# EAGLE design M8655B (EAGLE 6.6.0)

## Sheet 1 of 3
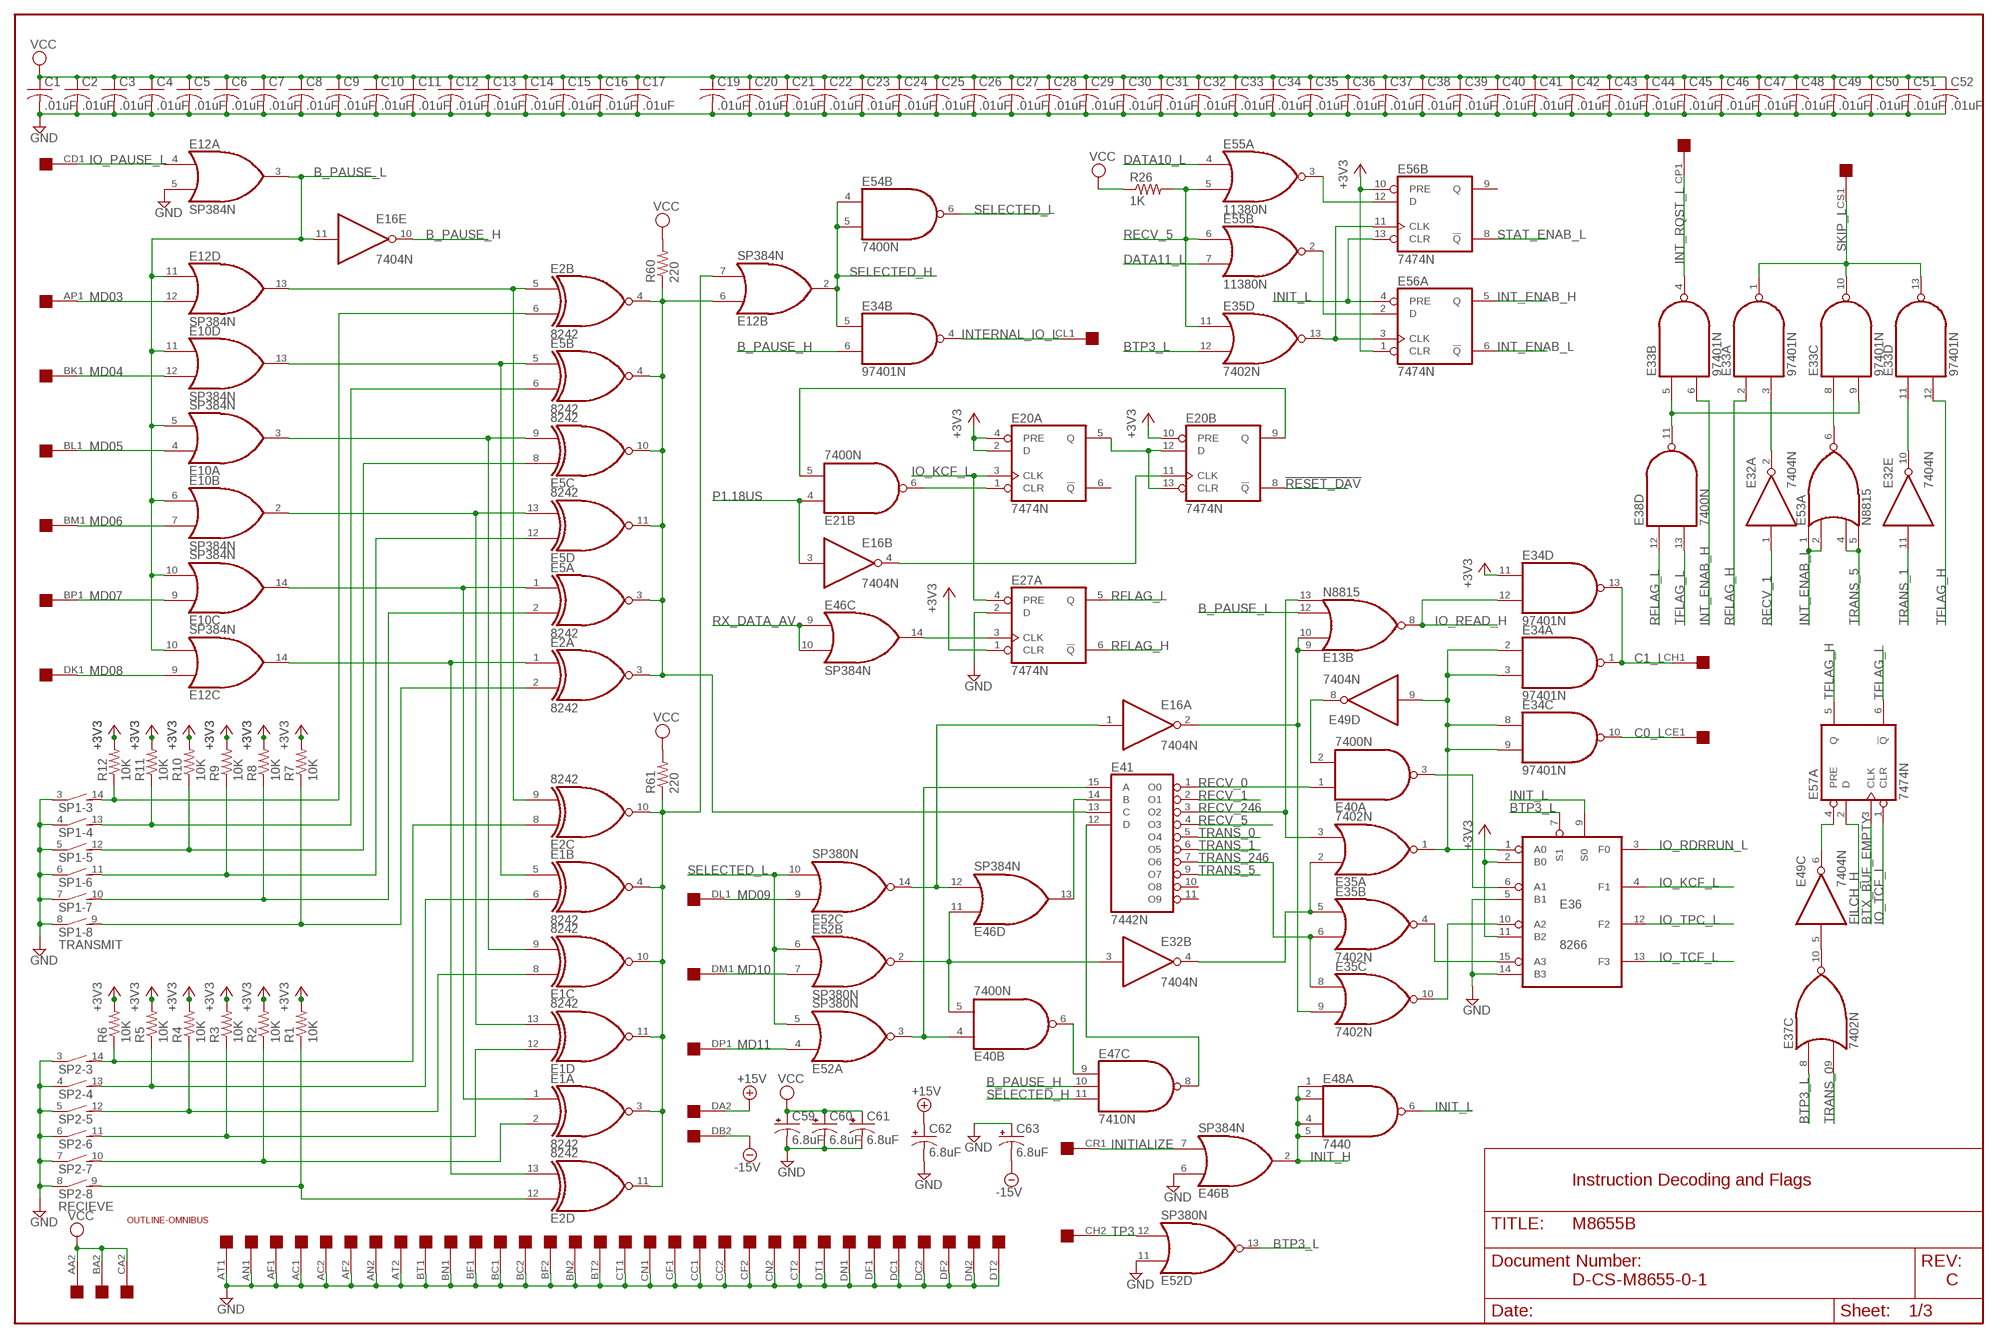
[diagram p0: schematic, sheet 1]

### Parts
C1  .01uF  C-US050-025X075  [C050-025X075]
C2  .01uF  C-US050-025X075  [C050-025X075]
C3  .01uF  C-US050-025X075  [C050-025X075]
C4  .01uF  C-US050-025X075  [C050-025X075]
C5  .01uF  C-US050-025X075  [C050-025X075]
C6  .01uF  C-US050-025X075  [C050-025X075]
C7  .01uF  C-US050-025X075  [C050-025X075]
C8  .01uF  C-US050-025X075  [C050-025X075]
C9  .01uF  C-US050-025X075  [C050-025X075]
C10  .01uF  C-US050-025X075  [C050-025X075]
C11  .01uF  C-US050-025X075  [C050-025X075]
C12  .01uF  C-US050-025X075  [C050-025X075]
C13  .01uF  C-US050-025X075  [C050-025X075]
C14  .01uF  C-US050-025X075  [C050-025X075]
C15  .01uF  C-US050-025X075  [C050-025X075]
C16  .01uF  C-US050-025X075  [C050-025X075]
C17  .01uF  C-US050-025X075  [C050-025X075]
C19  .01uF  C-US050-025X075  [C050-025X075]
C20  .01uF  C-US050-025X075  [C050-025X075]
C21  .01uF  C-US050-025X075  [C050-025X075]
C22  .01uF  C-US050-025X075  [C050-025X075]
C23  .01uF  C-US050-025X075  [C050-025X075]
C24  .01uF  C-US050-025X075  [C050-025X075]
C25  .01uF  C-US050-025X075  [C050-025X075]
C26  .01uF  C-US050-025X075  [C050-025X075]
C27  .01uF  C-US050-025X075  [C050-025X075]
C28  .01uF  C-US050-025X075  [C050-025X075]
C29  .01uF  C-US050-025X075  [C050-025X075]
C30  .01uF  C-US050-025X075  [C050-025X075]
C31  .01uF  C-US050-025X075  [C050-025X075]
C32  .01uF  C-US050-025X075  [C050-025X075]
C33  .01uF  C-US050-025X075  [C050-025X075]
C34  .01uF  C-US050-025X075  [C050-025X075]
C35  .01uF  C-US050-025X075  [C050-025X075]
C36  .01uF  C-US050-025X075  [C050-025X075]
C37  .01uF  C-US050-025X075  [C050-025X075]
C38  .01uF  C-US050-025X075  [C050-025X075]
C39  .01uF  C-US050-025X075  [C050-025X075]
C40  .01uF  C-US050-025X075  [C050-025X075]
C41  .01uF  C-US050-025X075  [C050-025X075]
C42  .01uF  C-US050-025X075  [C050-025X075]
C43  .01uF  C-US050-025X075  [C050-025X075]
C44  .01uF  C-US050-025X075  [C050-025X075]
C45  .01uF  C-US050-025X075  [C050-025X075]
C46  .01uF  C-US050-025X075  [C050-025X075]
C47  .01uF  C-US050-025X075  [C050-025X075]
C48  .01uF  C-US050-025X075  [C050-025X075]
C49  .01uF  C-US050-025X075  [C050-025X075]
C50  .01uF  C-US050-025X075  [C050-025X075]
C51  .01uF  C-US050-025X075  [C050-025X075]
C52  .01uF  C-US050-025X075  [C050-025X075]
C59  6.8uF  CPOL-USE20-8AXIAL  [E12-8]
C60  6.8uF  CPOL-USE20-8AXIAL  [E12-8]
C61  6.8uF  CPOL-USE20-8AXIAL  [E12-8]
C62  6.8uF  CPOL-USE20-8AXIAL  [E12-8]
C63  6.8uF  CPOL-USE20-8AXIAL  [E12-8]
E1  8242  74LS266N  [DIL14]
E2  8242  74LS266N  [DIL14]
E5  8242  74LS266N  [DIL14]
E10  SP384N  [DIL14]
E12  SP384N  [DIL14]
E13  N8815  [DIL14]
E16  7404N  [DIL14]
E20  7474N  74S74N  [DIL14]
E21  7400N  [DIL14]
E27  7474N  74S74N  [DIL14]
E32  7404N  [DIL14]
E33  97401N  74LS01N  [DIL14]
E34  97401N  74LS01N  [DIL14]
E35  7402N  [DIL14]
E36  8266  [DIL16]
E37  7402N  [DIL14]
E38  7400N  [DIL14]
E40  7400N  [DIL14]
E41  7442N  74LS42N  [DIL16]
E46  SP384N  [DIL14]
E47  7410N  [DIL14]
E48  7440  74S20N  [DIL14]
E49  7404N  [DIL14]
E52  SP380N  [DIL14]
E53  N8815  [DIL14]
E54  7400N  [DIL14]
E55  11380N  SP380N  [DIL14]
E56  7474N  74S74N  [DIL14]
E57  7474N  74S74N  [DIL14]
R1  10K  R-US_0207/10  [0207/10]
R2  10K  R-US_0207/10  [0207/10]
R3  10K  R-US_0207/10  [0207/10]
R4  10K  R-US_0207/10  [0207/10]
R5  10K  R-US_0207/10  [0207/10]
R6  10K  R-US_0207/10  [0207/10]
R7  10K  R-US_0207/10  [0207/10]
R8  10K  R-US_0207/10  [0207/10]
R9  10K  R-US_0207/10  [0207/10]
R10  10K  R-US_0207/10  [0207/10]
R11  10K  R-US_0207/10  [0207/10]
R12  10K  R-US_0207/10  [0207/10]
R26  1K  R-US_0207/10  [0207/10]
R60  220  R-US_0207/10  [0207/10]
R61  220  R-US_0207/10  [0207/10]
SP1  TRANSMIT  DIP08S  [DIP08S]
SP2  RECIEVE  DIP08S  [DIP08S]
U$1  OUTLINE-OMNIBUS  [OMNIBUS]
U$2  QUAD  [EDGE-CON8]

### Nets
!RESET_DAV: E20.8(B:!Q) ; also sheet 3
+3V3: E20.2(A:D) E20.4(A:PRE) E20.10(B:PRE) E27.1(A:CLR) E34.11(D:I0) E36.2(B0) E36.11(B2) E56.1(A:CLR) E56.10(B:PRE) R1.2 R2.2 R3.2 R4.2 R5.2 R6.2 R7.2 R8.2 R9.2 R10.2 R11.2 R12.2 ; also sheet 2,3
+15V: C62.+ U$2.DA2 ; also sheet 3
-15V: C63.- U$2.DB2 ; also sheet 3
B_PAUSE_H: E16.10(E:O) E34.6(B:I1) E47.10(C:I1)
B_PAUSE_L: E10.5(A:I1) E10.6(B:I0) E10.10(C:I1) E10.11(D:I0) E12.3(A:O) E12.10(C:I1) E12.11(D:I0) E13.12(B:I2) E16.11(E:I) ; also sheet 3
BTP3_L: E35.12(D:I1) E36.7(S1) E37.8(C:I0) E52.13(D:O)
BTX_BUF_EMPTY: E57.3(A:CLK) ; also sheet 2
C0_L: E34.10(C:O) U$2.CE1
C1_L: E34.1(A:O) E34.13(D:O) U$2.CH1
DATA10_L: E55.4(A:I0) ; also sheet 3
DATA11_L: E55.7(B:I1) ; also sheet 3
FILCH_H: E57.2(A:D) ; also sheet 2
GND: C1.2 C2.2 C3.2 C4.2 C5.2 C6.2 C7.2 C8.2 C9.2 C10.2 C11.2 C12.2 C13.2 C14.2 C15.2 C16.2 C17.2 C19.2 C20.2 C21.2 C22.2 C23.2 C24.2 C25.2 C26.2 C27.2 C28.2 C29.2 C30.2 C31.2 C32.2 C33.2 C34.2 C35.2 C36.2 C37.2 C38.2 C39.2 C40.2 C41.2 C42.2 C43.2 C44.2 C45.2 C46.2 C47.2 C48.2 C49.2 C50.2 C51.2 C52.2 C59.- C60.- C61.- C62.- C63.+ E12.5(A:I1) E27.2(A:D) E36.5(B1) E36.14(B3) E46.6(B:I0) E52.11(D:I0) SP1.3 SP1.4 SP1.5 SP1.6 SP1.7 SP1.8 SP2.3 SP2.4 SP2.5 SP2.6 SP2.7 SP2.8 U$2.AC1 U$2.AC2 U$2.AF1 U$2.AF2 U$2.AN1 U$2.AN2 U$2.AT1 U$2.AT2 U$2.BC1 U$2.BC2 U$2.BF1 U$2.BF2 U$2.BN1 U$2.BN2 U$2.BT1 U$2.BT2 U$2.CC1 U$2.CC2 U$2.CF1 U$2.CF2 U$2.CN1 U$2.CN2 U$2.CT1 U$2.CT2 U$2.DC1 U$2.DC2 U$2.DF1 U$2.DF2 U$2.DN1 U$2.DN2 U$2.DT1 U$2.DT2 ; also sheet 2,3
INIT_H: E46.2(B:O) E48.1(A:I0) E48.2(A:I1) E48.4(A:I2) E48.5(A:I3) ; also sheet 2
INIT_L: E36.9(S0) E48.6(A:O) E56.4(A:PRE) E56.13(B:CLR) ; also sheet 2,3
INITIALIZE: E46.7(B:I1) U$2.CR1
INT_ENAB_H: E33.6(B:I1) E56.5(A:Q)
INT_ENAB_L: E53.1(A:I0) E53.2(A:I1) E56.6(A:!Q)
INT_RQST_L: E33.4(B:O) U$2.CP1
INTERNAL_IO_L: E34.4(B:O) U$2.CL1
IO_KCF_L: E20.3(A:CLK) E27.4(A:PRE) E36.4(F1)
IO_PAUSE_L: E12.4(A:I0) U$2.CD1
IO_RDRRUN_L: E36.3(F0) ; also sheet 3
IO_READ_H: E13.8(B:O) E34.12(D:I1) ; also sheet 3
IO_TCF_L: E36.13(F3) E57.1(A:CLR)
IO_TPC_L: E36.12(F2) ; also sheet 2,3
MD03: E12.12(D:I1) U$2.AP1
MD04: E10.12(D:I1) U$2.BK1
MD05: E10.4(A:I0) U$2.BL1
MD06: E10.7(B:I1) U$2.BM1
MD07: E10.9(C:I0) U$2.BP1
MD08: E12.9(C:I0) U$2.DK1
MD09: E52.9(C:I0) U$2.DL1
MD10: E52.7(B:I1) U$2.DM1
MD11: E52.4(A:I0) U$2.DP1
N$1: E2.6(B:I1) R12.1 SP1.14
N$2: E5.6(B:I1) R11.1 SP1.13
N$3: E5.8(C:I0) R10.1 SP1.12
N$4: E5.12(D:I0) R9.1 SP1.11
N$5: E5.2(A:I1) R8.1 SP1.10
N$6: E2.2(A:I1) R7.1 SP1.9
N$7: E2.5(B:I0) E2.9(C:I1) E12.13(D:O)
N$8: E2.8(C:I0) R6.1 SP2.14
N$9: E1.6(B:I1) R5.1 SP2.13
N$10: E1.8(C:I0) R4.1 SP2.12
N$11: E1.12(D:I0) R3.1 SP2.11
N$12: E1.2(A:I1) R2.1 SP2.10
N$13: E2.12(D:I0) R1.1 SP2.9
N$14: E1.5(B:I0) E5.5(B:I0) E10.13(D:O)
N$15: E1.9(C:I1) E5.9(C:I1) E10.3(A:O)
N$16: E1.13(D:I1) E5.13(D:I1) E10.2(B:O)
N$17: E1.1(A:I0) E5.1(A:I0) E10.14(C:O)
N$18: E2.1(A:I0) E2.13(D:I1) E12.14(C:O)
N$19: E2.3(A:O) E2.4(B:O) E5.3(A:O) E5.4(B:O) E5.10(C:O) E5.11(D:O) E12.6(B:I0) E41.13(C) R60.1
N$20: E1.3(A:O) E1.4(B:O) E1.10(C:O) E1.11(D:O) E2.10(C:O) E2.11(D:O) E12.7(B:I1) R61.1
N$21: E32.3(B:I) E40.5(B:I1) E46.11(D:I0) E52.2(B:O)
N$22: E16.1(A:I) E46.12(D:I1) E52.14(C:O)
N$23: E40.4(B:I0) E41.15(A) E52.3(A:O)
N$24: E34.2(A:I0) E34.3(A:I1) E34.8(C:I0) E34.9(C:I1) E35.1(A:O) E36.1(A0) E49.9(D:I)
N$25: E41.14(B) E46.13(D:O)
N$26: E40.6(B:O) E47.9(C:I0)
N$27: E32.4(B:O) E35.2(A:I0) E35.5(B:I0)
N$28: E41.12(D) E47.8(C:O)
N$29: E13.9(B:I0) E13.10(B:I1) E16.2(A:O) E35.9(C:I1)
N$30: E40.2(A:I1) E49.8(D:O)
N$31: E35.4(B:O) E36.15(A3)
N$32: E35.10(C:O) E36.10(A2)
N$33: E36.6(A1) E40.3(A:O)
N$34: E20.5(A:Q) E20.12(B:D) E20.13(B:CLR)
N$35: E20.1(A:CLR) E21.6(B:O)
N$36: E27.3(A:CLK) E46.14(C:O)
N$37: E16.4(B:O) E20.11(B:CLK)
N$38: E20.9(B:Q) E21.5(B:I1)
N$39: E35.13(D:O) E56.3(A:CLK) E56.11(B:CLK)
N$40: E55.2(B:O) E56.2(A:D)
N$41: E55.3(A:O) E56.12(B:D)
N$42: E37.10(C:O) E49.5(C:I)
N$43: E49.6(C:O) E57.4(A:PRE)
N$45: E32.2(A:O) E33.3(A:I1)
N$46: E32.10(E:O) E33.11(D:I0)
N$47: E33.8(C:I0) E53.6(A:O)
N$48: E33.5(B:I0) E33.9(C:I1) E38.11(D:O)
P1.18US: E16.3(B:I) E21.4(B:I0) ; also sheet 2
RECV_0: E40.1(A:I0) E41.1(O0)
RECV_1: E32.1(A:I) E41.2(O1)
RECV_5: E35.11(D:I0) E41.4(O3) E55.5(A:I1) E55.6(B:I0) R26.2
RECV_246: E13.13(B:I3) E35.3(A:I1) E41.3(O2)
RFLAG_H: E27.6(A:!Q) E33.2(A:I0)
RFLAG_L: E27.5(A:Q) E38.12(D:I0)
RX_DATA_AV: E46.9(C:I0) E46.10(C:I1) ; also sheet 3
SELECTED_H: E12.2(B:O) E34.5(B:I0) E47.11(C:I2) E54.4(B:I0) E54.5(B:I1)
SELECTED_L: E52.5(A:I1) E52.6(B:I0) E52.10(C:I1) E54.6(B:O)
SKIP_L: E33.1(A:O) E33.10(C:O) E33.13(D:O) U$2.CS1
STAT_ENAB_L: E56.8(B:!Q) ; also sheet 3
TFLAG_H: E33.12(D:I1) E57.5(A:Q)
TFLAG_L: E38.13(D:I1) E57.6(A:!Q)
TP3: E52.12(D:I1) U$2.CH2
TRANS_0: E37.9(C:I1) E41.5(O4)
TRANS_1: E32.11(E:I) E41.6(O5)
TRANS_5: E41.9(O7) E53.4(A:I2) E53.5(A:I3)
TRANS_246: E35.6(B:I1) E35.8(C:I0) E41.7(O6)
VCC: C1.1 C2.1 C3.1 C4.1 C5.1 C6.1 C7.1 C8.1 C9.1 C10.1 C11.1 C12.1 C13.1 C14.1 C15.1 C16.1 C17.1 C19.1 C20.1 C21.1 C22.1 C23.1 C24.1 C25.1 C26.1 C27.1 C28.1 C29.1 C30.1 C31.1 C32.1 C33.1 C34.1 C35.1 C36.1 C37.1 C38.1 C39.1 C40.1 C41.1 C42.1 C43.1 C44.1 C45.1 C46.1 C47.1 C48.1 C49.1 C50.1 C51.1 C52.1 C59.+ C60.+ C61.+ R26.1 R60.2 R61.2 U$2.AA2 U$2.BA2 U$2.CA2 ; also sheet 2,3
Unconnected: E20.6(A:!Q) E38.1(A:I0) E38.2(A:I1) E38.3(A:O) E38.4(B:I0) E38.5(B:I1) E38.6(B:O) E38.8(C:O) E38.9(C:I0) E38.10(C:I1) E41.10(O8) E41.11(O9) E47.3(B:I0) E47.4(B:I1) E47.5(B:I2) E47.6(B:O) E56.9(B:Q) U$2.AA1 U$2.AB1 U$2.AB2 U$2.AD1 U$2.AD2 U$2.AE1 U$2.AE2 U$2.AH1 U$2.AH2 U$2.AJ1 U$2.AJ2 U$2.AK1 U$2.AK2 U$2.AL1 U$2.AL2 U$2.AM1 U$2.AM2 U$2.AP2 U$2.AR2 U$2.AS2 U$2.AU2 U$2.AV2 U$2.BA1 U$2.BB1 U$2.BB2 U$2.BD1 U$2.BD2 U$2.BE1 U$2.BE2 U$2.BH1 U$2.BH2 U$2.BJ1 U$2.BJ2 U$2.BK2 U$2.BL2 U$2.BM2 U$2.BP2 U$2.BR2 U$2.BS2 U$2.BU2 U$2.CA1 U$2.CB1 U$2.CB2 U$2.CD2 U$2.CE2 U$2.CJ1 U$2.CJ2 U$2.CK1 U$2.CK2 U$2.CL2 U$2.CM1 U$2.CM2 U$2.CP2 U$2.CR2 U$2.CS2 U$2.CU1 U$2.CU2 U$2.CV1 U$2.CV2 U$2.DA1 U$2.DB1 U$2.DD1 U$2.DD2 U$2.DE1 U$2.DE2 U$2.DH1 U$2.DH2 U$2.DJ1 U$2.DJ2 U$2.DK2 U$2.DL2 U$2.DM2 U$2.DP2 U$2.DR2 U$2.DS2 U$2.DU2 U$2.DV2

### Notes on the sheet
- Instruction Decoding and Flags
- D-CS-M8655-0-1 | C

## Sheet 2 of 3
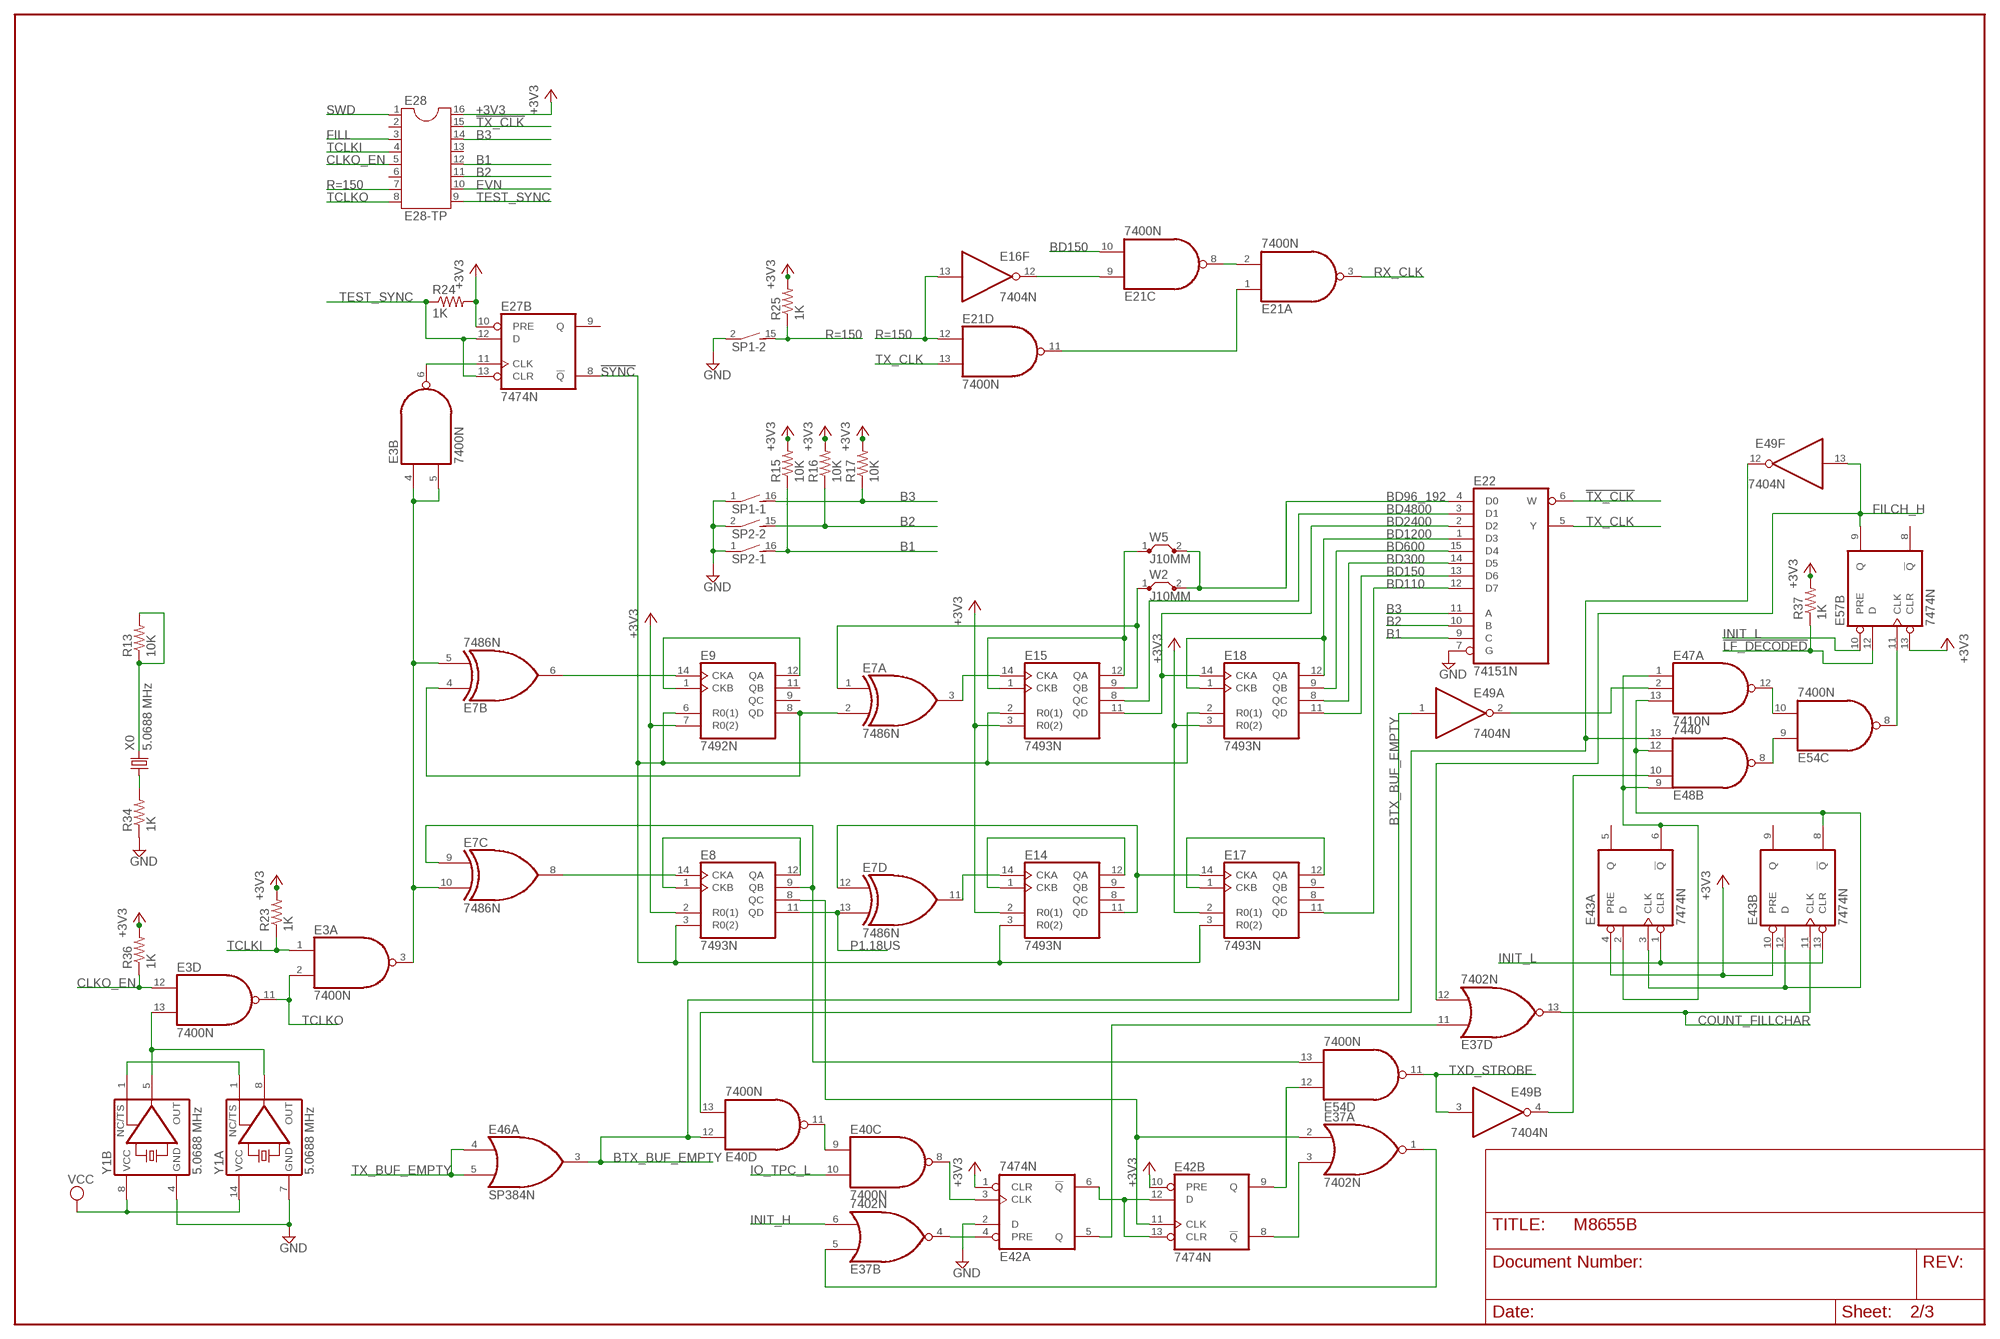
[diagram p1: schematic, sheet 2]

### Parts
E3  7400N  [DIL14]
E7  7486N  [DIL14]
E8  7493N  74LS93N  [DIL14]
E9  7492N  74LS92N  [DIL14]
E14  7493N  74LS93N  [DIL14]
E15  7493N  74LS93N  [DIL14]
E17  7493N  74LS93N  [DIL14]
E18  7493N  74LS93N  [DIL14]
E22  74151N  [DIL16]
E28  E28-TP  DIL16S  [SOCKET-16]
E42  7474N  74S74N  [DIL14]
E43  7474N  74S74N  [DIL14]
R13  10K  R-US_0207/10  [0207/10]
R15  10K  R-US_0207/10  [0207/10]
R16  10K  R-US_0207/10  [0207/10]
R17  10K  R-US_0207/10  [0207/10]
R23  1K  R-US_0207/10  [0207/10]
R24  1K  R-US_0207/10  [0207/10]
R25  1K  R-US_0207/10  [0207/10]
R34  1K  R-US_0207/10  [0207/10]
R36  1K  R-US_0207/10  [0207/10]
R37  1K  R-US_0207/10  [0207/10]
W2  J10MM  [10]
W5  J10MM  [10]
X0  5.0688 MHz  CRYSTALHC33U-H  [HC33U-H]
Y1A  5.0688 MHz  XO-14  [DIL14S]
Y1B  5.0688 MHz  XO-8  [DIL08S]

### Nets
!FILCH: E40.13(D:I1) E48.13(B:I3) E49.12(F:O)
!LF_DECODED: E57.12(B:D) R37.1 ; also sheet 3
!SYNC: E8.3(R0(2)) E9.6(R0(1)) E14.3(R0(2)) E15.2(R0(1)) E17.3(R0(2)) E18.2(R0(1)) E27.8(B:!Q)
!TX_CLK: E22.6(W) E28.15
+3V3: E8.2(R0(1)) E9.7(R0(2)) E14.2(R0(1)) E15.3(R0(2)) E17.2(R0(1)) E18.3(R0(2)) E27.10(B:PRE) E28.16 E42.1(A:CLR) E42.10(B:PRE) E43.4(A:PRE) E43.10(B:PRE) E57.13(B:CLR) R15.2 R16.2 R17.2 R23.2 R24.2 R25.2 R36.2 R37.2 ; also sheet 1,3
B1: E22.9(C) E28.12 R15.1 SP2.16
B2: E22.10(B) E28.11 R16.1 SP2.15
B3: E22.11(A) E28.14 R17.1 SP1.16
BD96_192: E22.4(D0) W2.2 W5.2
BD110: E17.11(QD) E22.12(D7)
BD150: E18.11(QD) E21.10(C:I1) E22.13(D6)
BD300: E18.8(QC) E22.14(D5)
BD600: E18.9(QB) E22.15(D4)
BD1200: E18.1(CKB) E18.12(QA) E22.1(D3)
BD2400: E15.11(QD) E18.14(CKA) E22.2(D2)
BD4800: E15.8(QC) E22.3(D1)
BTX_BUF_EMPTY: E40.12(D:I0) E46.3(A:O) E49.1(A:I) ; also sheet 1
CLKO_EN: E3.12(D:I0) E28.5 R36.1
COUNT_FILLCHAR: E37.13(D:O) E43.11(B:CLK) ; also sheet 3
EVN: E28.10 ; also sheet 3
FILCH_H: E37.12(D:I1) E49.13(F:I) E57.9(B:Q) ; also sheet 1
FILL: E28.3 ; also sheet 3
GND: E22.7(G) E42.2(A:D) R34.1 SP1.1 SP1.2 SP2.1 SP2.2 Y1A.7(GND) Y1B.4(GND) ; also sheet 1,3
INIT_H: E37.6(B:I1) ; also sheet 1
INIT_L: E43.1(A:CLR) E43.13(B:CLR) E57.10(B:PRE) ; also sheet 1,3
IO_TPC_L: E40.10(C:I1) ; also sheet 1,3
N$44: E3.6(B:O) E27.11(B:CLK)
N$49: E3.3(A:O) E3.4(B:I0) E3.5(B:I1) E7.5(B:I1) E7.10(C:I1)
N$50: E3.13(D:I1) Y1A.8(OUT) Y1B.5(OUT)
N$51: Y1A.1(TS) Y1B.1(TS)
N$52: E8.1(CKB) E8.12(QA)
N$53: E7.9(C:I0) E8.9(QB) E54.13(D:I1)
N$54: E7.8(C:O) E8.14(CKA)
N$55: E7.6(B:O) E9.14(CKA)
N$56: E9.1(CKB) E9.12(QA)
N$57: E7.2(A:I1) E7.4(B:I0) E9.8(QD)
N$58: E7.3(A:O) E15.14(CKA)
N$59: E15.1(CKB) E15.12(QA) W5.1
N$60: E7.1(A:I0) E15.9(QB) W2.1
N$61: E16.12(F:O) E21.9(C:I0)
N$62: E21.2(A:I1) E21.8(C:O)
N$63: E21.1(A:I0) E21.11(D:O)
N$65: E7.11(D:O) E14.14(CKA)
N$66: E14.1(CKB) E14.12(QA)
N$67: E7.12(D:I0) E14.11(QD) E17.14(CKA)
N$68: E17.1(CKB) E17.12(QA)
N$70: E40.9(C:I0) E40.11(D:O)
N$71: E37.1(A:O) E37.5(B:I0)
N$72: E37.4(B:O) E42.4(A:PRE)
N$73: E8.8(QC) E37.2(A:I0) E42.11(B:CLK)
N$74: E40.8(C:O) E42.3(A:CLK)
N$75: E42.6(A:!Q) E42.12(B:D) E42.13(B:CLR)
N$76: E37.11(D:I0) E42.5(A:Q)
N$77: E43.2(A:D) E43.6(A:!Q) E47.1(A:I0) E48.9(B:I0)
N$78: E42.9(B:Q) E54.12(D:I0)
N$79: E37.3(A:I1) E42.8(B:!Q)
N$80: E43.3(A:CLK) E43.8(B:!Q) E43.12(B:D) E47.13(A:I2) E48.12(B:I2)
N$81: E47.2(A:I1) E49.2(A:O)
N$82: E48.10(B:I1) E49.4(B:O)
N$83: E47.12(A:O) E54.10(C:I1)
N$84: E48.8(B:O) E54.9(C:I0)
N$85: E54.8(C:O) E57.11(B:CLK)
N$148: R34.2 X0.1
N$149: R13.1 R13.2 X0.2
P1.18US: E7.13(D:I1) E8.11(QD) ; also sheet 1
R=150: E16.13(F:I) E21.12(D:I0) E28.7 R25.1 SP1.15
RX_CLK: E21.3(A:O) ; also sheet 3
SWD: E28.1 ; also sheet 3
TCLKI: E3.1(A:I0) E28.4 R23.1
TCLKO: E3.2(A:I1) E3.11(D:O) E28.8
TEST_SYNC: E27.12(B:D) E27.13(B:CLR) E28.9 R24.1
TX_BUF_EMPTY: E46.4(A:I0) E46.5(A:I1) ; also sheet 3
TX_CLK: E21.13(D:I1) E22.5(Y) ; also sheet 3
TXD_STROBE: E49.3(B:I) E54.11(D:O) ; also sheet 3
VCC: Y1A.14(VCC) Y1B.8(VCC) ; also sheet 1,3
Unconnected: E3.8(C:O) E3.9(C:I0) E3.10(C:I1) E9.9(QC) E9.11(QB) E14.8(QC) E14.9(QB) E17.8(QC) E17.9(QB) E27.9(B:Q) E28.2 E28.6 E28.13 E43.5(A:Q) E43.9(B:Q) E57.8(B:!Q)

## Sheet 3 of 3
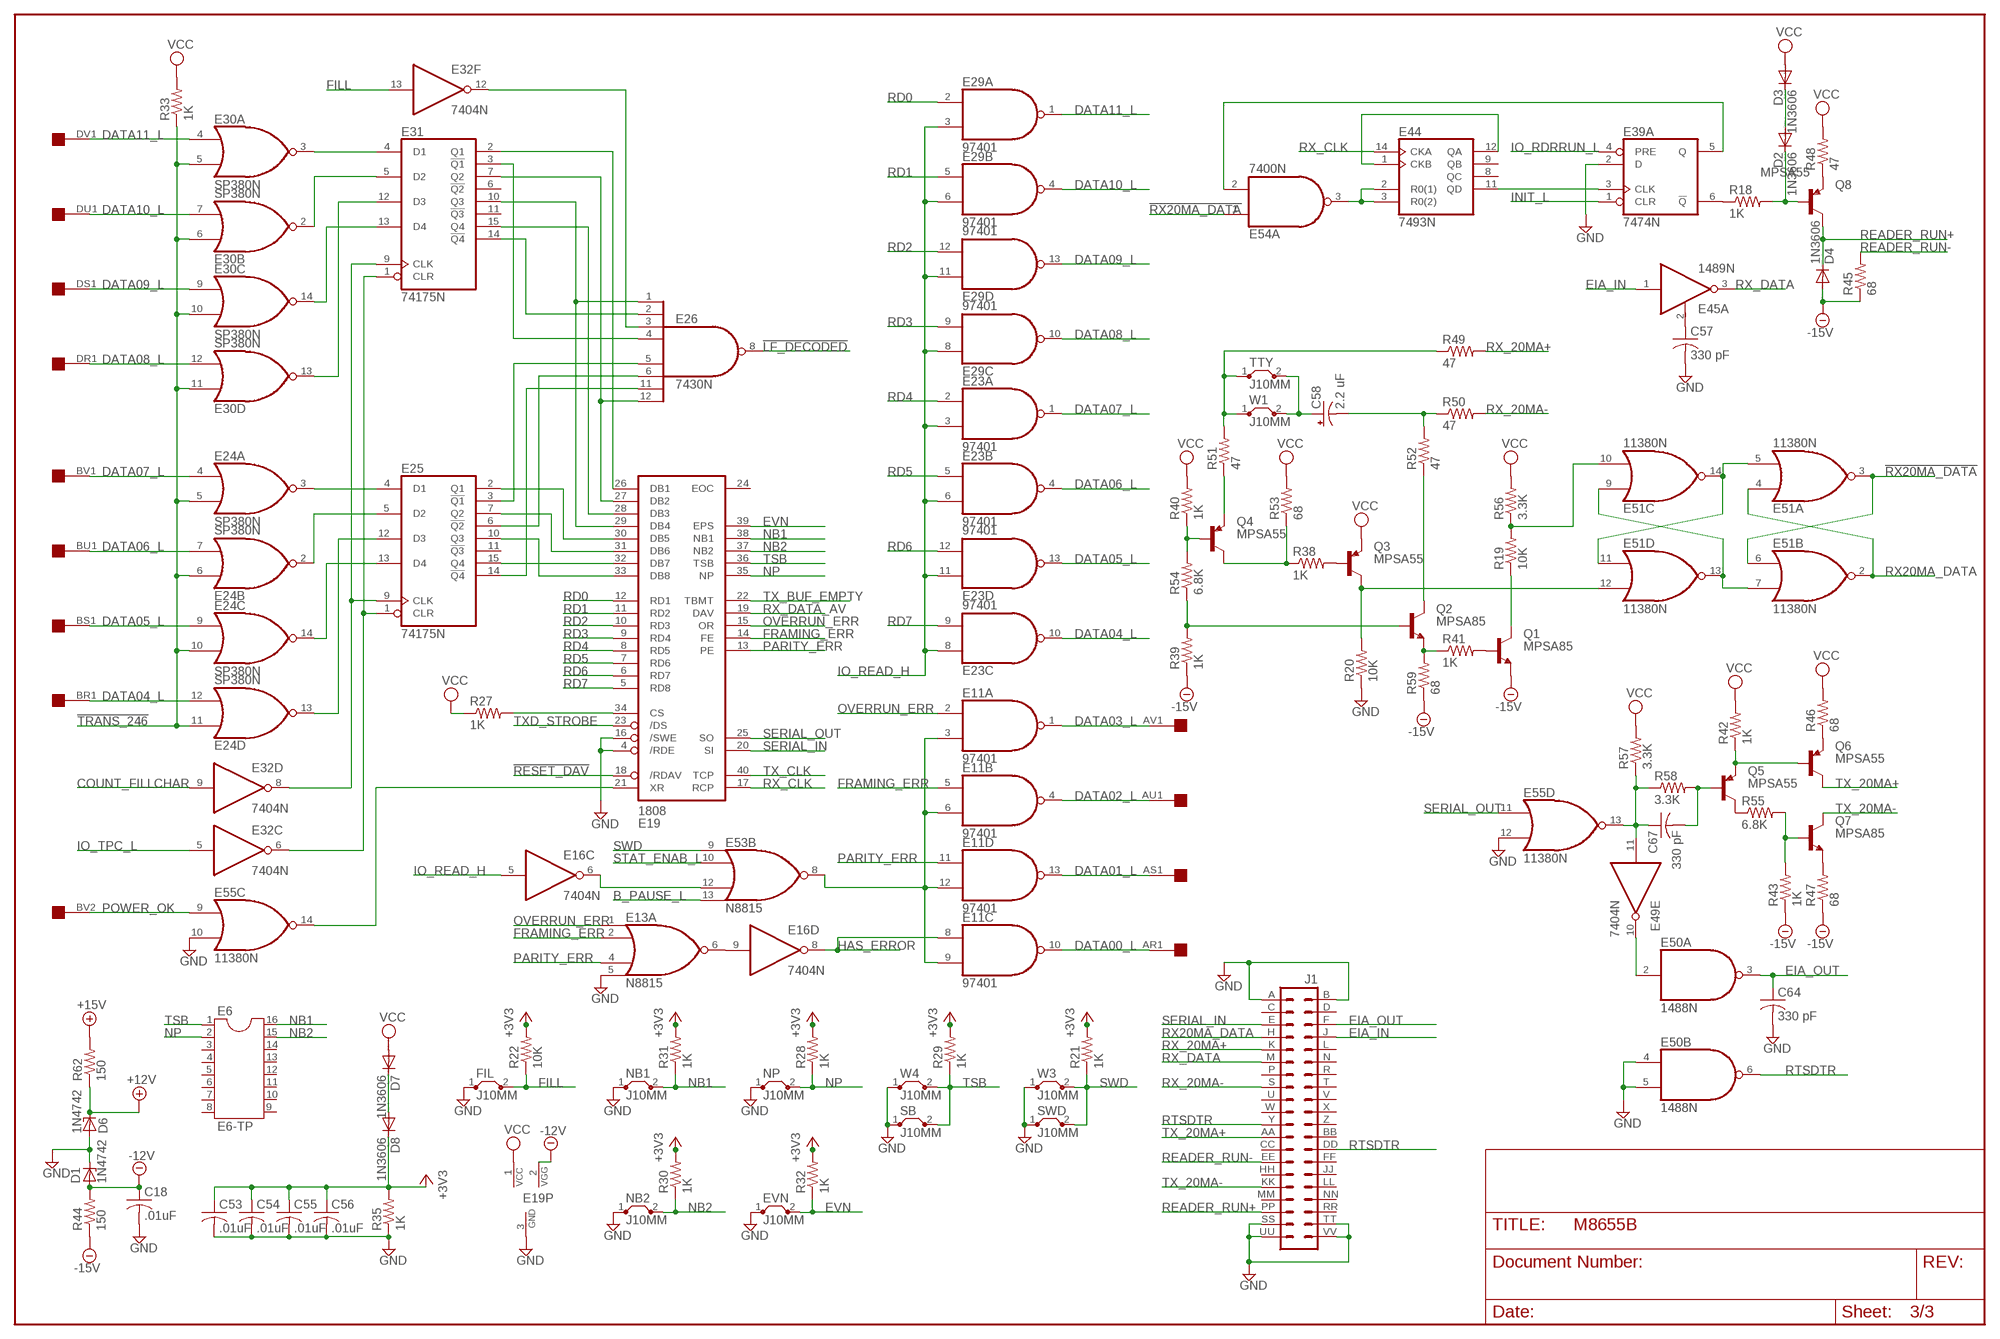
[diagram p2: schematic, sheet 3]

### Parts
C18  .01uF  C-US050-025X075  [C050-025X075]
C53  .01uF  C-US050-025X075  [C050-025X075]
C54  .01uF  C-US050-025X075  [C050-025X075]
C55  .01uF  C-US050-025X075  [C050-025X075]
C56  .01uF  C-US050-025X075  [C050-025X075]
C57  330 pF  C-US050-025X075  [C050-025X075]
C58  2.2 uF  CPOL-USE20-8AXIAL  [E12-8]
C64  330 pF  C-US050-025X075  [C050-025X075]
C67  330 pF  C-US050-025X075  [C050-025X075]
D1  1N4742  ZENER-DIODEDO41Z10  [DO41Z10]
D2  1N3606  DIODE-DO35-10  [DO35-10]
D3  1N3606  DIODE-DO35-10  [DO35-10]
D4  1N3606  DIODE-DO35-10  [DO35-10]
D6  1N4742  ZENER-DIODEDO41Z10  [DO41Z10]
D7  1N3606  DIODE-DO35-10  [DO35-10]
D8  1N3606  DIODE-DO35-10  [DO35-10]
E6  E6-TP  DIL16S  [SOCKET-16]
E11  97401  74LS01N  [DIL14]
E19  1808  AY-5-1013A  [DIL40]
E23  97401  74LS01N  [DIL14]
E24  SP380N  [DIL14]
E25  74175N  [DIL16]
E26  7430N  [DIL14]
E29  97401  74LS01N  [DIL14]
E30  SP380N  [DIL14]
E31  74175N  [DIL16]
E39  7474N  74S74N  [DIL14]
E44  7493N  74LS93N  [DIL14]
E45  1489N  [DIL14]
E50  1488N  [DIL14]
E51  11380N  SP380N  [DIL14]
EVN  J10MM  [10]
FIL  J10MM  [10]
J1  DEC40PINH  [DEC40PINH]
NB1  J10MM  [10]
NB2  J10MM  [10]
NP  J10MM  [10]
Q1  MPSA85  -NPN-TO5  [TO5]
Q2  MPSA85  -NPN-TO5  [TO5]
Q3  MPSA55  -PNP-TO5  [TO5]
Q4  MPSA55  -PNP-TO5  [TO5]
Q5  MPSA55  -PNP-TO5  [TO5]
Q6  MPSA55  -PNP-TO5  [TO5]
Q7  MPSA85  -NPN-TO5  [TO5]
Q8  MPSA55  -PNP-TO5  [TO5]
R18  1K  R-US_0207/10  [0207/10]
R19  10K  R-US_0207/10  [0207/10]
R20  10K  R-US_0207/10  [0207/10]
R21  1K  R-US_0207/10  [0207/10]
R22  10K  R-US_0207/10  [0207/10]
R27  1K  R-US_0207/10  [0207/10]
R28  1K  R-US_0207/10  [0207/10]
R29  1K  R-US_0207/10  [0207/10]
R30  1K  R-US_0207/10  [0207/10]
R31  1K  R-US_0207/10  [0207/10]
R32  1K  R-US_0207/10  [0207/10]
R33  1K  R-US_0207/10  [0207/10]
R35  1K  R-US_0207/10  [0207/10]
R38  1K  R-US_0207/10  [0207/10]
R39  1K  R-US_0207/10  [0207/10]
R40  1K  R-US_0207/10  [0207/10]
R41  1K  R-US_0207/10  [0207/10]
R42  1K  R-US_0207/10  [0207/10]
R43  1K  R-US_0207/10  [0207/10]
R44  150  R-US_0207/10  [0207/10]
R45  68  R-US_0207/10  [0207/10]
R46  68  R-US_0207/10  [0207/10]
R47  68  R-US_0207/10  [0207/10]
R48  47  R-US_0207/10  [0207/10]
R49  47  R-US_0207/10  [0207/10]
R50  47  R-US_0207/10  [0207/10]
R51  47  R-US_0207/10  [0207/10]
R52  47  R-US_0207/10  [0207/10]
R53  68  R-US_0207/10  [0207/10]
R54  6.8K  R-US_0207/10  [0207/10]
R55  6.8K  R-US_0207/10  [0207/10]
R56  3.3K  R-US_0207/10  [0207/10]
R57  3.3K  R-US_0207/10  [0207/10]
R58  3.3K  R-US_0207/10  [0207/10]
R59  68  R-US_0207/10  [0207/10]
R62  150  R-US_0207/10  [0207/10]
SB  J10MM  [10]
SWD  J10MM  [10]
TTY  J10MM  [10]
W1  J10MM  [10]
W3  J10MM  [10]
W4  J10MM  [10]

### Nets
!LF_DECODED: E26.8(O) ; also sheet 2
!RESET_DAV: E19.18(/RDAV) ; also sheet 1
!RX20MA_DATA: E51.3(A:O) E51.6(B:I0) E54.1(A:I0)
!TRANS_246: E24.5(A:I1) E24.6(B:I0) E24.10(C:I1) E24.11(D:I0) E30.5(A:I1) E30.6(B:I0) E30.10(C:I1) E30.11(D:I0) R33.1
+3V3: C53.1 C54.1 C55.1 C56.1 D8.C R21.2 R22.2 R28.2 R29.2 R30.2 R31.2 R32.2 R35.2 ; also sheet 1,2
+12V: D6.C R62.1
+15V: R62.2 ; also sheet 1
-12V: C18.1 D1.A E19.2(VGG) R44.2
-15V: D4.A Q1.1(E) R39.1 R43.1 R44.1 R45.1 R47.1 R59.1 ; also sheet 1
B_PAUSE_L: E53.13(B:I3) ; also sheet 1
COUNT_FILLCHAR: E32.9(D:I) ; also sheet 2
DATA00_L: E11.10(C:O) U$2.AR1
DATA01_L: E11.13(D:O) U$2.AS1
DATA02_L: E11.4(B:O) U$2.AU1
DATA03_L: E11.1(A:O) U$2.AV1
DATA04_L: E23.10(C:O) E24.12(D:I1) U$2.BR1
DATA05_L: E23.13(D:O) E24.9(C:I0) U$2.BS1
DATA06_L: E23.4(B:O) E24.7(B:I1) U$2.BU1
DATA07_L: E23.1(A:O) E24.4(A:I0) U$2.BV1
DATA08_L: E29.10(C:O) E30.12(D:I1) U$2.DR1
DATA09_L: E29.13(D:O) E30.9(C:I0) U$2.DS1
DATA10_L: E29.4(B:O) E30.7(B:I1) U$2.DU1 ; also sheet 1
DATA11_L: E29.1(A:O) E30.4(A:I0) U$2.DV1 ; also sheet 1
EIA_IN: E45.1(A:I) J1.J
EIA_OUT: C64.1 E50.3(A:O) J1.F
EVN: E19.39(EPS) EVN.2 R32.1 ; also sheet 2
FILL: E32.13(F:I) FIL.2 R22.1 ; also sheet 2
FRAMING_ERR: E11.5(B:I0) E13.2(A:I1) E19.14(FE)
GND: C18.2 C53.2 C54.2 C55.2 C56.2 C57.2 C64.2 D1.C D6.A E13.5(A:I3) E19.3(GND) E19.4(/RDE) E19.16(/SWE) E39.2(A:D) E50.4(B:I0) E50.5(B:I1) E55.10(C:I1) E55.12(D:I1) EVN.1 FIL.1 J1.A J1.B J1.SS J1.TT J1.UU J1.VV NB1.1 NB2.1 NP.1 R20.1 R35.1 SB.1 SWD.1 W3.1 W4.1 ; also sheet 1,2
HAS_ERROR: E11.8(C:I0) E16.8(D:O)
INIT_L: E39.1(A:CLR) ; also sheet 1,2
IO_RDRRUN_L: E39.4(A:PRE) ; also sheet 1
IO_READ_H: E16.5(C:I) E23.3(A:I1) E23.6(B:I1) E23.8(C:I0) E23.11(D:I0) E29.3(A:I1) E29.6(B:I1) E29.8(C:I0) E29.11(D:I0) ; also sheet 1
IO_TPC_L: E32.5(C:I) ; also sheet 1,2
N$69: E30.3(A:O) E31.4(D1)
N$86: E30.2(B:O) E31.5(D2)
N$87: E30.14(C:O) E31.13(D4)
N$88: E30.13(D:O) E31.12(D3)
N$89: E19.26(DB1) E31.2(Q1)
N$90: E24.3(A:O) E25.4(D1)
N$91: E24.2(B:O) E25.5(D2)
N$92: E24.14(C:O) E25.13(D4)
N$93: E24.13(D:O) E25.12(D3)
N$94: E25.9(CLK) E31.9(CLK) E32.8(D:O)
N$95: E25.1(CLR) E31.1(CLR) E32.6(C:O)
N$96: E19.27(DB2) E26.12(I7) E31.7(Q2)
N$97: E19.28(DB3) E31.15(Q4)
N$98: E19.29(DB4) E26.1(I0) E31.10(Q3)
N$99: E19.30(DB5) E25.2(Q1)
N$100: E19.31(DB6) E25.7(Q2)
N$101: E19.33(DB8) E25.10(Q3)
N$102: E19.32(DB7) E25.15(Q4)
N$103: E26.4(I3) E31.3(!Q1)
N$104: E26.2(I1) E31.14(!Q4)
N$105: E26.3(I2) E32.12(F:O)
N$106: E25.3(!Q1) E26.5(I4)
N$107: E25.6(!Q2) E26.6(I5)
N$108: E25.14(!Q4) E26.11(I6)
N$110: E11.3(A:I1) E11.6(B:I1) E11.9(C:I1) E11.12(D:I1) E53.8(B:O)
N$111: E13.6(A:O) E16.9(D:I)
N$112: E19.34(CS) R27.2
N$113: E44.2(R0(1)) E44.3(R0(2)) E54.3(A:O)
N$114: E44.1(CKB) E44.12(QA)
N$115: E16.6(C:O) E53.12(B:I2)
N$116: E39.3(A:CLK) E44.11(QD)
N$117: E39.5(A:Q) E54.2(A:I1)
N$118: E39.6(A:!Q) R18.1
N$119: D2.C Q8.2(B) R18.2
N$120: Q8.1(E) R48.1
N$121: D2.A D3.C
N$122: C57.1 E45.2(A:RC)
N$123: C58.- R50.1 R52.2
N$124: C58.+ TTY.2 W1.2
N$125: R49.1 R51.2 TTY.1 W1.1
N$126: E49.10(E:O) E50.2(A:I)
N$127: Q6.1(E) R46.1
N$128: Q7.1(E) R47.2
N$129: Q5.1(E) Q6.2(B) R42.1
N$130: Q5.3(C) R55.1
N$131: Q7.2(B) R43.2 R55.2
N$132: C67.2 Q5.2(B) R58.2
N$133: C67.1 E49.11(E:I) E55.13(D:O) R57.1 R58.1
N$134: Q2.2(B) R39.2 R54.1
N$135: Q4.2(B) R40.1 R54.2
N$136: Q4.3(C) R38.1 R53.1
N$137: Q4.1(E) R51.1
N$138: Q3.2(B) R38.2
N$139: E51.12(D:I1) Q3.3(C) R20.2
N$140: Q2.3(C) R52.1
N$141: Q2.1(E) R41.1 R59.2
N$142: Q1.2(B) R41.2
N$143: Q1.3(C) R19.1
N$144: E51.10(C:I1) R19.2 R56.1
N$145: E51.7(B:I1) E51.9(C:I0) E51.13(D:O)
N$146: E51.5(A:I1) E51.11(D:I0) E51.14(C:O)
N$147: D7.C D8.A
NB1: E6.16 E19.38(NB1) NB1.2 R31.1
NB2: E6.15 E19.37(NB2) NB2.2 R30.1
NP: E6.2 E19.35(NP) NP.2 R28.1
OVERRUN_ERR: E11.2(A:I0) E13.1(A:I0) E19.15(OR)
PARITY_ERR: E11.11(D:I0) E13.4(A:I2) E19.13(PE)
POWER_OK: E55.9(C:I0) U$2.BV2
RD0: E19.12(RD1) E29.2(A:I0)
RD1: E19.11(RD2) E29.5(B:I0)
RD2: E19.10(RD3) E29.12(D:I1)
RD3: E19.9(RD4) E29.9(C:I1)
RD4: E19.8(RD5) E23.2(A:I0)
RD5: E19.7(RD6) E23.5(B:I0)
RD6: E19.6(RD7) E23.12(D:I1)
RD7: E19.5(RD8) E23.9(C:I1)
READER_RUN+: D4.C J1.PP Q8.3(C)
READER_RUN-: J1.EE R45.2
RTSDTR: E50.6(B:O) J1.DD J1.Y
RX20MA_DATA: E51.2(B:O) E51.4(A:I0) J1.H
RX_20MA+: J1.K R49.2
RX_20MA-: J1.S R50.2
RX_CLK: E19.17(RCP) E44.14(CKA) ; also sheet 2
RX_DATA: E45.3(A:O) J1.M
RX_DATA_AV: E19.19(DAV) ; also sheet 1
SERIAL_IN: E19.20(SI) J1.E
SERIAL_OUT: E19.25(SO) E55.11(D:I0)
STAT_ENAB_L: E53.10(B:I1) ; also sheet 1
SWD: E53.9(B:I0) R21.1 SWD.2 W3.2 ; also sheet 2
TSB: E6.1 E19.36(TSB) R29.1 SB.2 W4.2
TX_20MA+: J1.AA Q6.3(C)
TX_20MA-: J1.KK Q7.3(C)
TX_BUF_EMPTY: E19.22(TBMT) ; also sheet 2
TX_CLK: E19.40(TCP) ; also sheet 2
TXD_STROBE: E19.23(/DS) ; also sheet 2
VCC: D3.A D7.A E19.1(VCC) Q3.1(E) R27.1 R33.2 R40.2 R42.2 R46.2 R48.2 R53.2 R56.2 R57.2 ; also sheet 1,2
XR: E19.21(XR) E55.14(C:O)
Unconnected: E6.3 E6.4 E6.5 E6.6 E6.7 E6.8 E6.9 E6.10 E6.11 E6.12 E6.13 E6.14 E19.24(EOC) E25.11(!Q3) E31.6(!Q2) E31.11(!Q3) E39.8(B:!Q) E39.9(B:Q) E39.10(B:PRE) E39.11(B:CLK) E39.12(B:D) E39.13(B:CLR) E44.8(QC) E44.9(QB) E45.4(B:I) E45.5(B:RC) E45.6(B:O) E45.8(C:O) E45.9(C:RC) E45.10(C:I) E45.11(D:O) E45.12(D:RC) E45.13(D:I) E50.8(C:O) E50.9(C:I0) E50.10(C:I1) E50.11(D:O) E50.12(D:I0) E50.13(D:I1) J1.BB J1.C J1.CC J1.D J1.FF J1.HH J1.JJ J1.L J1.LL J1.MM J1.N J1.NN J1.P J1.R J1.RR J1.T J1.U J1.V J1.W J1.X J1.Z

## Power pins joined to a net without a drawn wire
+12V: E50.14(P:+12V)
-12V: E50.1(P:-12V)
GND: E1.7(P:GND) E2.7(P:GND) E3.7(P:GND) E5.7(P:GND) E7.7(P:GND) E8.10(GND) E9.10(GND) E10.1(GND) E11.7(P:GND) E12.1(GND) E13.7(P:GND) E14.10(GND) E15.10(GND) E16.7(P:GND) E17.10(GND) E18.10(GND) E20.7(P:GND) E21.7(P:GND) E22.8(GND) E23.7(P:GND) E24.1(P:GND) E25.8(GND) E26.7(GND) E27.7(P:GND) E29.7(P:GND) E30.1(P:GND) E31.8(GND) E32.7(P:GND) E33.7(P:GND) E34.7(P:GND) E35.7(P:GND) E36.8(GND) E37.7(P:GND) E38.7(P:GND) E39.7(P:GND) E40.7(P:GND) E41.8(GND) E42.7(P:GND) E43.7(P:GND) E44.10(GND) E45.7(P:GND) E46.1(GND) E47.7(P:GND) E48.7(P:GND) E49.7(P:GND) E50.7(P:GND) E51.1(P:GND) E52.1(P:GND) E53.7(P:GND) E54.7(P:GND) E55.1(P:GND) E56.7(P:GND) E57.7(P:GND)
VCC: E1.14(P:VCC) E2.14(P:VCC) E3.14(P:VCC) E5.14(P:VCC) E7.14(P:VCC) E8.5(VCC) E9.5(VCC) E10.8(VCC) E11.14(P:VCC) E12.8(VCC) E13.14(P:VCC) E14.5(VCC) E15.5(VCC) E16.14(P:VCC) E17.5(VCC) E18.5(VCC) E20.14(P:VCC) E21.14(P:VCC) E22.16(VCC) E23.14(P:VCC) E24.8(P:VCC) E25.16(VCC) E26.14(VCC) E27.14(P:VCC) E29.14(P:VCC) E30.8(P:VCC) E31.16(VCC) E32.14(P:VCC) E33.14(P:VCC) E34.14(P:VCC) E35.14(P:VCC) E36.16(VCC) E37.14(P:VCC) E38.14(P:VCC) E39.14(P:VCC) E40.14(P:VCC) E41.16(VCC) E42.14(P:VCC) E43.14(P:VCC) E44.5(VCC) E45.14(P:VCC) E46.8(VCC) E47.14(P:VCC) E48.14(P:VCC) E49.14(P:VCC) E51.8(P:VCC) E52.8(P:VCC) E53.14(P:VCC) E54.14(P:VCC) E55.8(P:VCC) E56.14(P:VCC) E57.14(P:VCC)

## Library data of the parts
C1-C57 C64 C67 = rcl:C-US: CAPACITOR, American symbol
C58-C63 = dec-con:CPOL-USE20-8AXIAL: A 0.8 inch electrolytic.
D1 D6 = diode:ZENER-DIODE: Z-Diode
D2-D4 D7 D8 = diode:DIODE-: DIODE
E1 E2 E5 = 74xx-us:74*266: Quadruple EXCLUSIVE-NOR (XNOR), open-collector
E3 E21 E38 E40 E54 = 74xx-us:74*00: Quad 2-input NAND gate
E6 E28 = ic-package:DIL16: Dual In Line / Socket
E7 = 74xx-us:74*86: Quad 2-input EXCLUSIV-OR (XOR) gate
E8 E14 E15 E17 E18 E44 = 74xx-us:74*93: Decade, divide by twelve and binary COUNTER
E9 = 74xx-us:74*92: Decade, divide by twelve and binary COUNTER
E10 E12 E46 = dec-con:SP384: Quad OR gate
E11 E23 E29 E33 E34 = 74xx-us:74*01: Quad 2-input NAND gate, open collector
E13 E53 = dec-con:N8815: Dual 4 Input NOR Gate
E16 E32 E49 = 74xx-us:74*04: Hex INVERTER
E19 = dec-con:AY-5-1013A: UART
E20 E27 E39 E42 E43 E56 E57 = 74xx-us:74*74: Dual D type positive edge triggered FLIP FLOP, preset and clear
E22 = 74xx-us:74*151: Data SELECTOR/MULTIPLEXER
E24 E30 E51 E52 E55 = dec-con:SP380: Quad NOR gate (use 8640)
E25 E31 = 74xx-us:74*175: Qadruple D type FLIP FLOP, clear
E26 = 74xx-us:74*30: 8-input NAND gate
E35 E37 = 74xx-us:74*02: Quad 2-input NOR gate
E36 = dec-con:8266: Quad 2-1 selector
E41 = 74xx-us:74*42: 4-line to 10-line DECODER (1-of-10)
E45 = dec-con:14*89: Quad line receivers BUFFER,
E47 = 74xx-us:74*10: Triple 3-input NAND gate
E48 = 74xx-us:74*20: Dual 4-input NAND gate
E50 = dec-con:14*88: Quad 2-input NAND gate
EVN FIL NB1 NB2 NP SB SWD TTY W1-W5 = jumper:J: Bridge
J1 = dec-con:DEC40PIN: PIN HEADER
Q1 Q2 Q7 = transistor:*-NPN-: NPN Transistror BF959 corrected 2008.03.06
Q3-Q6 Q8 = transistor:*-PNP-: PNP Transistror
R1-R13 R15-R62 = rcl:R-US_: RESISTOR, American symbol
SP1 SP2 = switch-dil:DIP08S: DIL/CODE SWITCH; OC_FARNELL: unknown; OC_NEWARK: unknown
U$1 = dec-con:OUTLINE-*: Board outlines for DEC boards.
U$2 = dec-con:QUAD: Quad-Height DEC board
X0 = crystal:CRYSTAL: CRYSTAL; OC_FARNELL: unknown; OC_NEWARK: unknown
Y1A Y1B = crystal:XO-: CRYSTAL; OC_FARNELL: unknown; OC_NEWARK: unknown

## Board
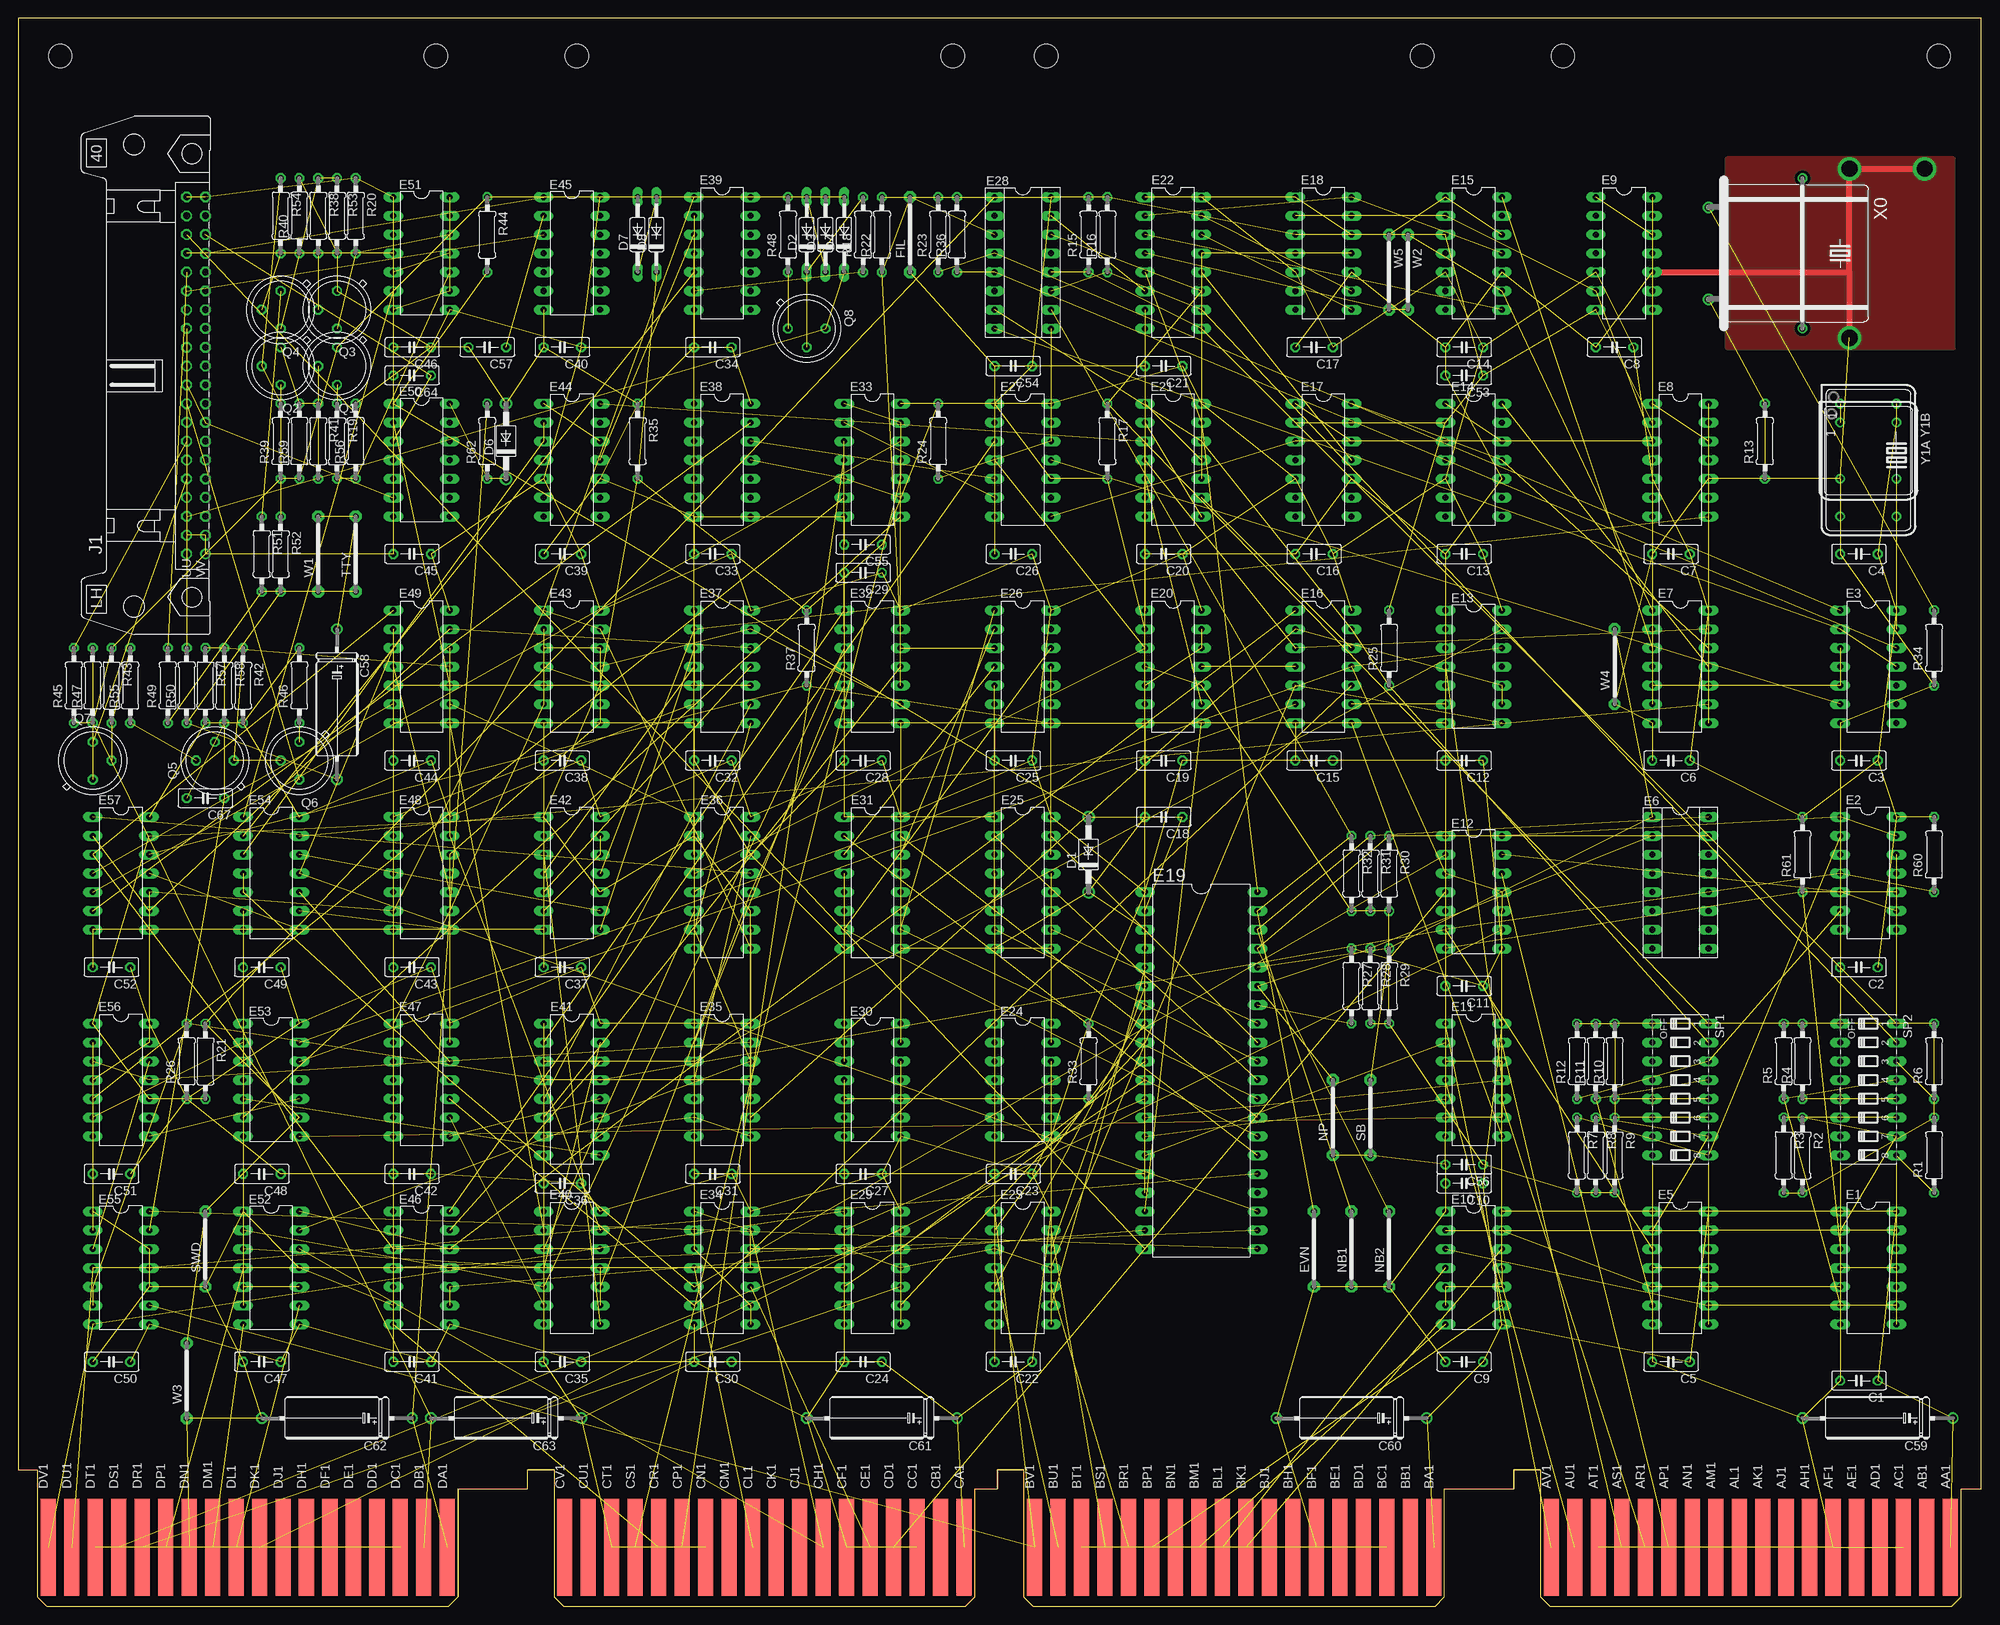
[diagram p3: board, top side]
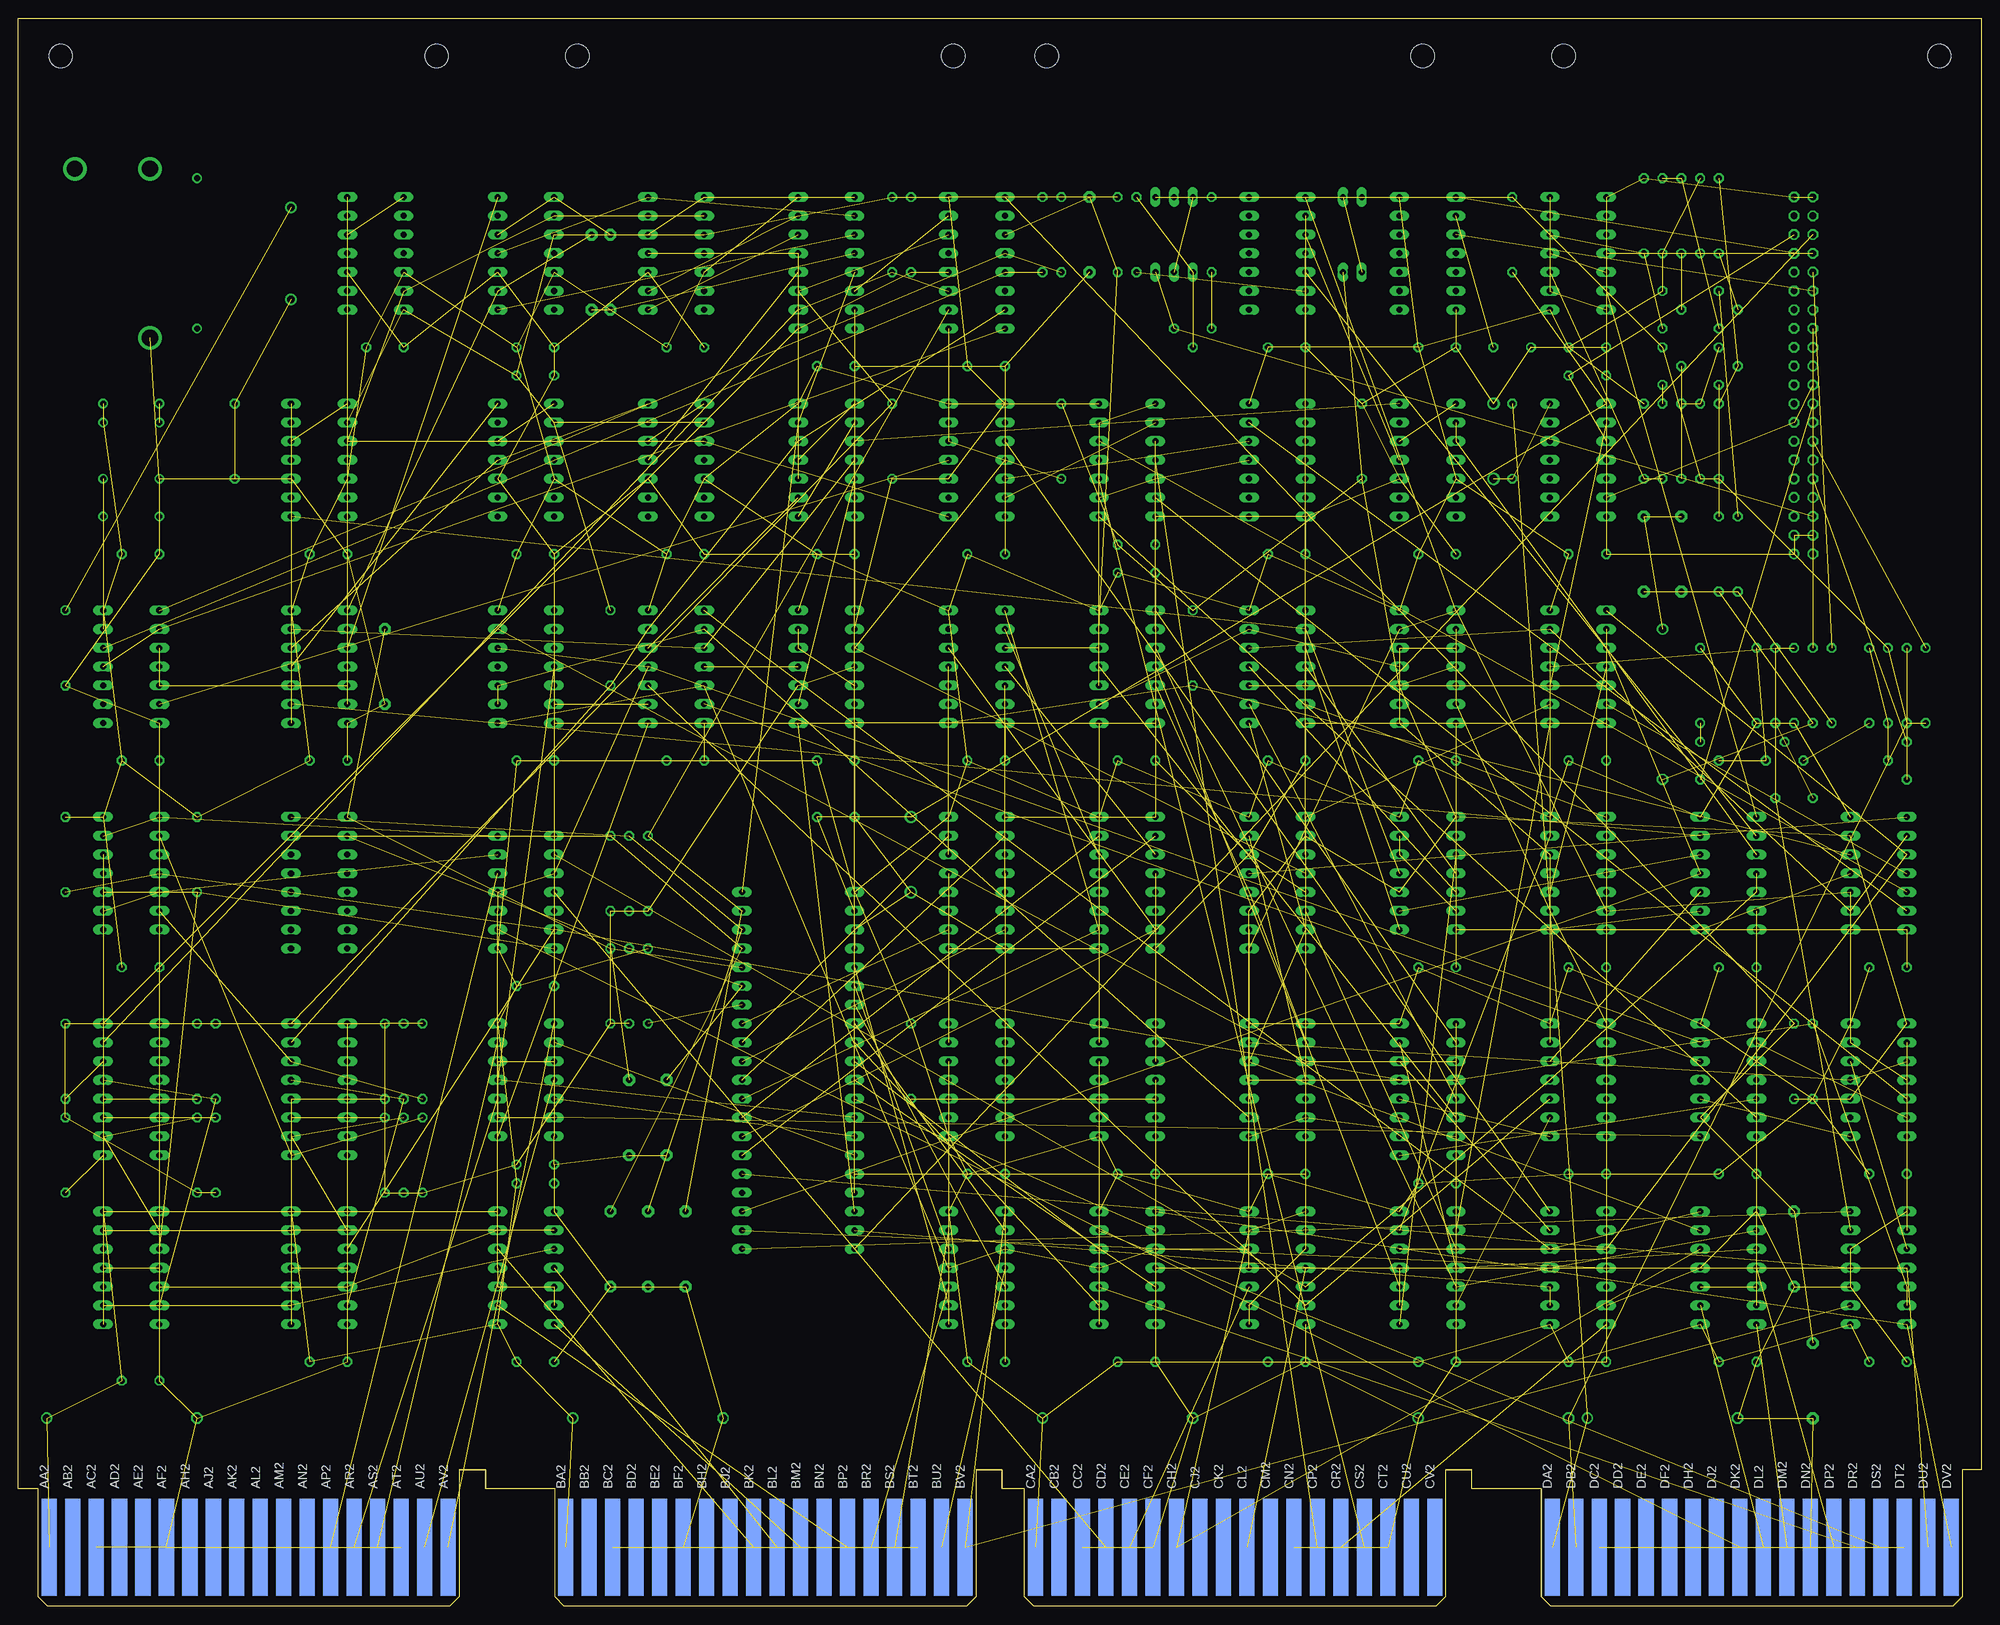
[diagram p4: board, bottom side, seen from below]

Size 265.3 x 214.63 mm. Coordinates in mm from the lower left corner, seen from the top.
Copper layers (1+16): Top 0.035mm / dielectric 1.5mm / Bottom 0.035mm
Design rules "16mils": minimum track width 16mil, minimum drill 32mil, track to track 15mil, track to pad 10mil, pad to pad 10mil, via to via 10mil, smd to smd 10mil, copper to edge 13mil, drill to drill 10mil, minimum pad ring 10mil, minimum via ring 8mil, stop-mask expansion 0mil, vias tented up to drill 0mil, thermal gap 10mil

### Footprints (pad centres in the part's own frame; a part is rotated, then mirrored left to right if it is on the bottom)
C050-025X075 = drill 0.813 octagon: 1 -2.54,0; 2 2.54,0
E12-8 = drill 1.016: + -10.16,0 | drill 1.016 octagon: - 10.16,0
DO41Z10 = drill 1.118: A 5.08,0; C -5.08,0
DO35-10 = drill 0.813 long: A 5.08,0; C -5.08,0
DIL14 = drill 0.813 long: 1 -7.62,-3.81; 2 -5.08,-3.81; 3 -2.54,-3.81; 4 0,-3.81; 5 2.54,-3.81; 6 5.08,-3.81; 7 7.62,-3.81; 8 7.62,3.81; 9 5.08,3.81; 10 2.54,3.81; 11 0,3.81; 12 -2.54,3.81; 13 -5.08,3.81; 14 -7.62,3.81
SOCKET-16 = drill 0.813 long: 1 -8.89,-3.81; 2 -6.35,-3.81; 3 -3.81,-3.81; 4 -1.27,-3.81; 5 1.27,-3.81; 6 3.81,-3.81; 7 6.35,-3.81; 8 8.89,-3.81; 9 8.89,3.81; 10 6.35,3.81; 11 3.81,3.81; 12 1.27,3.81; 13 -1.27,3.81; 14 -3.81,3.81; 15 -6.35,3.81; 16 -8.89,3.81
DIL40 = drill 0.813 long: 1 -24.13,-7.62; 2 -21.59,-7.62; 3 -19.05,-7.62; 4 -16.51,-7.62; 5 -13.97,-7.62; 6 -11.43,-7.62; 7 -8.89,-7.62; 8 -6.35,-7.62; 9 -3.81,-7.62; 10 -1.27,-7.62; 11 1.27,-7.62; 12 3.81,-7.62; 13 6.35,-7.62; 14 8.89,-7.62; 15 11.43,-7.62; 16 13.97,-7.62; 17 16.51,-7.62; 18 19.05,-7.62; 19 21.59,-7.62; 20 24.13,-7.62; 21 24.13,7.62; 22 21.59,7.62; 23 19.05,7.62; 24 16.51,7.62; 25 13.97,7.62; 26 11.43,7.62; 27 8.89,7.62; 28 6.35,7.62; 29 3.81,7.62; 30 1.27,7.62; 31 -1.27,7.62; 32 -3.81,7.62; 33 -6.35,7.62; 34 -8.89,7.62; 35 -11.43,7.62; 36 -13.97,7.62; 37 -16.51,7.62; 38 -19.05,7.62; 39 -21.59,7.62; 40 -24.13,7.62
DIL16 = drill 0.813 long: 1 -8.89,-3.81; 2 -6.35,-3.81; 3 -3.81,-3.81; 4 -1.27,-3.81; 5 1.27,-3.81; 6 3.81,-3.81; 7 6.35,-3.81; 8 8.89,-3.81; 9 8.89,3.81; 10 6.35,3.81; 11 3.81,3.81; 12 1.27,3.81; 13 -1.27,3.81; 14 -3.81,3.81; 15 -6.35,3.81; 16 -8.89,3.81
10 = drill 0.813 pad 1.6 octagon: 1 -5.08,0; 2 5.08,0
DEC40PINH = drill 0.914 octagon: A 24.13,1.27; AA -3.81,1.27; B 24.13,-1.27; BB -3.81,-1.27; C 21.59,1.27; CC -6.35,1.27; D 21.59,-1.27; DD -6.35,-1.27; E 19.05,1.27; EE -8.89,1.27; F 19.05,-1.27; FF -8.89,-1.27; H 16.51,1.27; HH -11.43,1.27; J 16.51,-1.27; JJ -11.43,-1.27; K 13.97,1.27; KK -13.97,1.27; L 13.97,-1.27; LL -13.97,-1.27; M 11.43,1.27; MM -16.51,1.27; N 11.43,-1.27; NN -16.51,-1.27; P 8.89,1.27; PP -19.05,1.27; R 8.89,-1.27; RR -19.05,-1.27; S 6.35,1.27; SS -21.59,1.27; T 6.35,-1.27; TT -21.59,-1.27; U 3.81,1.27; UU -24.13,1.27; V 3.81,-1.27; W 1.27,1.27; X 1.27,-1.27; Y -1.27,1.27; Z -1.27,-1.27 | drill 0.914: VV -24.13,-1.27
TO5 = drill 0.813 octagon: 1 0,-2.54; 2 2.54,0; 3 0,2.54
0207/10 = drill 0.813 octagon: 1 -5.08,0; 2 5.08,0
DIP08S = drill 0.813 long: 1 -8.89,-3.81; 2 -6.35,-3.81; 3 -3.81,-3.81; 4 -1.27,-3.81; 5 1.27,-3.81; 6 3.81,-3.81; 7 6.35,-3.81; 8 8.89,-3.81; 9 8.89,3.81; 10 6.35,3.81; 11 3.81,3.81; 12 1.27,3.81; 13 -1.27,3.81; 14 -3.81,3.81; 15 -6.35,3.81; 16 -8.89,3.81
OMNIBUS = hole 3.175: 208.915,209.55; 259.715,209.55; 189.865,209.55; 139.065,209.55; 75.616,209.55; 126.416,209.55; 56.566,209.55; 5.766,209.55
EDGE-CON8 = smd 2.032 x 13.106: AA1 261.303,7.938; AB1 258.127,7.938; AC1 254.952,7.938; AD1 251.778,7.938; AE1 248.602,7.938; AF1 245.428,7.938; AH1 242.252,7.938; AJ1 239.077,7.938; AK1 235.903,7.938; AL1 232.727,7.938; AM1 229.553,7.938; AN1 226.377,7.938; AP1 223.202,7.938; AR1 220.028,7.938; AS1 216.852,7.938; AT1 213.678,7.938; AU1 210.502,7.938; AV1 207.327,7.938; BA1 191.452,7.938; BB1 188.278,7.938; BC1 185.102,7.938; BD1 181.928,7.938; BE1 178.752,7.938; BF1 175.577,7.938; BH1 172.403,7.938; BJ1 169.227,7.938; BK1 166.053,7.938; BL1 162.877,7.938; BM1 159.702,7.938; BN1 156.528,7.938; BP1 153.352,7.938; BR1 150.178,7.938; BS1 147.002,7.938; BT1 143.827,7.938; BU1 140.653,7.938; BV1 137.477,7.938; CA1 127.953,7.938; CB1 124.778,7.938; CC1 121.603,7.938; CD1 118.427,7.938; CE1 115.252,7.938; CF1 112.078,7.938; CH1 108.903,7.938; CJ1 105.728,7.938; CK1 102.552,7.938; CL1 99.377,7.938; CM1 96.203,7.938; CN1 93.028,7.938; CP1 89.853,7.938; CR1 86.677,7.938; CS1 83.502,7.938; CT1 80.328,7.938; CU1 77.153,7.938; CV1 73.978,7.938; DA1 58.102,7.938; DB1 54.928,7.938; DC1 51.752,7.938; DD1 48.578,7.938; DE1 45.403,7.938; DF1 42.227,7.938; DH1 39.053,7.938; DJ1 35.877,7.938; DK1 32.703,7.938; DL1 29.527,7.938; DM1 26.352,7.938; DN1 23.177,7.938; DP1 20.003,7.938; DR1 16.828,7.938; DS1 13.652,7.938; DT1 10.477,7.938; DU1 7.303,7.938; DV1 4.128,7.938 | smd 2.032 x 13.106 bottom: AA2 261.303,7.938; AB2 258.127,7.938; AC2 254.952,7.938; AD2 251.778,7.938; AE2 248.602,7.938; AF2 245.428,7.938; AH2 242.252,7.938; AJ2 239.077,7.938; AK2 235.903,7.938; AL2 232.727,7.938; AM2 229.553,7.938; AN2 226.377,7.938; AP2 223.202,7.938; AR2 220.028,7.938; AS2 216.852,7.938; AT2 213.678,7.938; AU2 210.502,7.938; AV2 207.327,7.938; BA2 191.452,7.938; BB2 188.278,7.938; BC2 185.102,7.938; BD2 181.928,7.938; BE2 178.752,7.938; BF2 175.577,7.938; BH2 172.403,7.938; BJ2 169.227,7.938; BK2 166.053,7.938; BL2 162.877,7.938; BM2 159.702,7.938; BN2 156.528,7.938; BP2 153.352,7.938; BR2 150.178,7.938; BS2 147.002,7.938; BT2 143.827,7.938; BU2 140.653,7.938; BV2 137.477,7.938; CA2 127.953,7.938; CB2 124.778,7.938; CC2 121.603,7.938; CD2 118.427,7.938; CE2 115.252,7.938; CF2 112.078,7.938; CH2 108.903,7.938; CJ2 105.728,7.938; CK2 102.552,7.938; CL2 99.377,7.938; CM2 96.203,7.938; CN2 93.028,7.938; CP2 89.853,7.938; CR2 86.677,7.938; CS2 83.502,7.938; CT2 80.328,7.938; CU2 77.153,7.938; CV2 73.978,7.938; DA2 58.102,7.938; DB2 54.928,7.938; DC2 51.752,7.938; DD2 48.578,7.938; DE2 45.403,7.938; DF2 42.227,7.938; DH2 39.053,7.938; DJ2 35.877,7.938; DK2 32.703,7.938; DL2 29.527,7.938; DM2 26.352,7.938; DN2 23.177,7.938; DP2 20.003,7.938; DR2 16.828,7.938; DS2 13.652,7.938; DT2 10.477,7.938; DU2 7.303,7.938; DV2 4.128,7.938
HC33U-H = drill 1.016: 1 -6.223,-5.08; 2 6.223,-5.08 | drill 0.813: M -10.16,7.62; M1 10.16,7.62
DIL14S = drill 0.813: 1 -7.62,-3.81; 7 7.62,-3.81; 8 7.62,3.81; 14 -7.62,3.81
DIL08S = drill 0.813: 1 -3.81,-3.81; 4 3.81,-3.81; 5 3.81,3.81; 8 -3.81,3.81

### Placement (x,y rotation side)
C1  248.79,30.48 180 top
C2  248.79,86.36 180 top
C3  248.79,114.3 180 top
C4  248.79,142.24 180 top
C5  223.39,33.02 180 top
C6  223.39,114.3 180 top
C7  223.39,142.24 180 top
C8  215.77,170.18 180 top
C9  195.45,33.02 180 top
C10  195.45,57.15 180 top
C11  195.45,83.82 180 top
C12  195.45,114.3 180 top
C13  195.45,142.24 180 top
C14  195.45,170.18 180 top
C15  175.13,114.3 180 top
C16  175.13,142.24 180 top
C17  175.13,170.18 180 top
C18  154.81,106.68 180 top
C19  154.81,114.3 180 top
C20  154.81,142.24 180 top
C21  154.81,167.64 180 top
C22  134.49,33.02 180 top
C23  134.49,58.42 180 top
C24  114.17,33.02 180 top
C25  134.49,114.3 180 top
C26  134.49,142.24 180 top
C27  114.17,58.42 180 top
C28  114.17,114.3 180 top
C29  114.17,139.7 180 top
C30  93.85,33.02 180 top
C31  93.85,58.42 180 top
C32  93.85,114.3 180 top
C33  93.85,142.24 180 top
C34  93.85,170.18 180 top
C35  73.53,33.02 180 top
C36  73.53,57.15 180 top
C37  73.53,86.36 180 top
C38  73.53,114.3 180 top
C39  73.53,142.24 180 top
C40  73.53,170.18 180 top
C41  53.21,33.02 180 top
C42  53.21,58.42 180 top
C43  53.21,86.36 180 top
C44  53.21,114.3 180 top
C45  53.21,142.24 180 top
C46  53.21,170.18 180 top
C47  32.89,33.02 180 top
C48  32.89,58.42 180 top
C49  32.89,86.36 180 top
C50  12.57,33.02 180 top
C51  12.57,58.42 180 top
C52  12.57,86.36 180 top
C53  195.45,166.37 180 top
C54  134.49,167.64 180 top
C55  114.17,143.51 180 top
C56  195.45,59.69 180 top
C57  63.37,170.18 180 top
C58  43.05,121.92 270 top
C59  251.33,25.4 180 top
C60  180.21,25.4 180 top
C61  116.71,25.4 180 top
C62  43.05,25.4 180 top
C63  65.91,25.4 180 top
C64  53.21,166.37 180 top
C67  25.27,109.22 180 top
D1  144.65,101.6 90 top
D2  106.55,185.42 90 top
D3  109.09,185.42 90 top
D4  111.63,185.42 90 top
D6  65.91,157.48 90 top
D7  83.69,185.42 90 top
D8  86.23,185.42 90 top
E1  250.06,45.72 270 top
E2  250.06,99.06 270 top
E3  250.06,127 270 top
E5  224.66,45.72 270 top
E6  224.66,97.79 270 top
E7  224.66,127 270 top
E8  224.66,154.94 270 top
E9  217.04,182.88 270 top
E10  196.72,45.72 270 top
E11  196.72,71.12 270 top
E12  196.72,96.52 270 top
E13  196.72,127 270 top
E14  196.72,154.94 270 top
E15  196.72,182.88 270 top
E16  176.4,127 270 top
E17  176.4,154.94 270 top
E18  176.4,182.88 270 top
E19  159.89,72.39 270 top
E20  156.08,127 270 top
E21  156.08,154.94 270 top
E22  156.08,181.61 270 top
E23  135.76,45.72 270 top
E24  135.76,71.12 270 top
E25  135.76,97.79 270 top
E26  135.76,127 270 top
E27  135.76,154.94 270 top
E28  135.76,181.61 270 top
E29  115.44,45.72 270 top
E30  115.44,71.12 270 top
E31  115.44,97.79 270 top
E32  115.44,127 270 top
E33  115.44,154.94 270 top
E34  95.12,45.72 270 top
E35  95.12,71.12 270 top
E36  95.12,97.79 270 top
E37  95.12,127 270 top
E38  95.12,154.94 270 top
E39  95.12,182.88 270 top
E40  74.8,45.72 270 top
E41  74.8,69.85 270 top
E42  74.8,99.06 270 top
E43  74.8,127 270 top
E44  74.8,154.94 270 top
E45  74.8,182.88 270 top
E46  54.48,45.72 270 top
E47  54.48,71.12 270 top
E48  54.48,99.06 270 top
E49  54.48,127 270 top
E50  54.48,154.94 270 top
E51  54.48,182.88 270 top
E52  34.16,45.72 270 top
E53  34.16,71.12 270 top
E54  34.16,99.06 270 top
E55  13.84,45.72 270 top
E56  13.84,71.12 270 top
E57  13.84,99.06 270 top
EVN  175.13,48.26 90 top
FIL  120.52,185.42 90 top
J1  24,166.37 90 top
NB1  180.21,48.26 90 top
NB2  185.29,48.26 90 top
NP  177.67,66.04 90 top
Q1  43.05,167.64 180 top
Q2  35.43,167.64 180 top
Q3  43.05,175.26 180 top
Q4  35.43,175.26 180 top
Q5  26.54,114.3 90 top
Q6  37.97,114.3 180 top
Q7  10.03,114.3 0 top
Q8  106.55,172.72 270 top
R1  258.95,60.96 90 top
R2  241.17,60.96 270 top
R3  238.63,60.96 270 top
R4  241.17,73.66 90 top
R5  238.63,73.66 90 top
R6  258.95,73.66 90 top
R7  210.69,60.96 270 top
R8  213.23,60.96 270 top
R9  215.77,60.96 270 top
R10  215.77,73.66 90 top
R11  213.23,73.66 90 top
R12  210.69,73.66 90 top
R13  236.09,157.48 90 top
R15  144.65,185.42 90 top
R16  147.19,185.42 90 top
R17  147.19,157.48 270 top
R18  114.17,185.42 90 top
R19  43.05,157.48 270 top
R20  45.59,187.96 270 top
R21  25.27,73.66 270 top
R22  116.71,185.42 90 top
R23  124.33,185.42 90 top
R24  124.33,157.48 90 top
R25  185.29,129.54 90 top
R26  22.73,73.66 90 top
R27  180.21,83.82 270 top
R28  182.75,83.82 270 top
R29  185.29,83.82 270 top
R30  185.29,99.06 270 top
R31  182.75,99.06 270 top
R32  180.21,99.06 270 top
R33  144.65,73.66 90 top
R34  258.95,129.54 90 top
R35  83.69,157.48 270 top
R36  126.87,185.42 90 top
R37  106.55,129.54 90 top
R38  40.51,187.96 270 top
R39  35.43,157.48 90 top
R40  37.97,187.96 90 top
R41  40.51,157.48 270 top
R42  30.35,124.46 270 top
R43  12.57,124.46 270 top
R44  63.37,185.42 270 top
R45  7.49,124.46 90 top
R46  37.97,124.46 90 top
R47  10.03,124.46 90 top
R48  104.01,185.42 90 top
R49  20.19,124.46 90 top
R50  22.73,124.46 90 top
R51  32.89,142.24 270 top
R52  35.43,142.24 270 top
R53  43.05,187.96 270 top
R54  35.43,187.96 270 top
R55  15.11,124.46 90 top
R56  45.59,157.48 90 top
R57  25.27,124.46 270 top
R58  27.81,124.46 270 top
R59  37.97,157.48 90 top
R60  258.95,101.6 90 top
R61  241.17,101.6 90 top
R62  63.37,157.48 90 top
SB  182.75,66.04 90 top
SP1  224.66,69.85 270 top
SP2  250.06,69.85 270 top
SWD  25.27,48.26 90 top
TTY  45.59,142.24 90 top
U$1  -0.13,0 0 top
U$2  -0.13,0 0 top
W1  40.51,142.24 90 top
W2  187.83,180.34 270 top
W3  22.73,30.48 90 top
W4  215.77,127 90 top
W5  185.29,180.34 270 top
X0  233.55,182.88 270 top
Y1A  250.06,154.94 270 top
Y1B  250.06,156.21 270 top

### Tracks (layer width: path | path; a pad name or v marks a point on that pad's centre or on a via)
!FILCH  (2 unrouted)
!LF_DECODED  (2 unrouted)
!RESET_DAV  (1 unrouted)
!RX20MA_DATA  (2 unrouted)
!SYNC  (6 unrouted)
!TRANS_246  (8 unrouted)
!TX_CLK  (1 unrouted)
+3V3  (54 unrouted)
+12V  (2 unrouted)
+15V  (2 unrouted)
-12V  (4 unrouted)
-15V  (9 unrouted)
B1  (3 unrouted)
B2  (3 unrouted)
B3  (3 unrouted)
B_PAUSE_H  (2 unrouted)
B_PAUSE_L  (9 unrouted)
BD96_192  (2 unrouted)
BD110  (1 unrouted)
BD150  (2 unrouted)
BD300  (1 unrouted)
BD600  (1 unrouted)
BD1200  (2 unrouted)
BD2400  (2 unrouted)
BD4800  (1 unrouted)
BTP3_L  (3 unrouted)
BTX_BUF_EMPTY  (3 unrouted)
C0_L  (1 unrouted)
C1_L  (2 unrouted)
CLKO_EN  (2 unrouted)
COUNT_FILLCHAR  (2 unrouted)
DATA00_L  (1 unrouted)
DATA01_L  (1 unrouted)
DATA02_L  (1 unrouted)
DATA03_L  (1 unrouted)
DATA04_L  (2 unrouted)
DATA05_L  (2 unrouted)
DATA06_L  (2 unrouted)
DATA07_L  (2 unrouted)
DATA08_L  (2 unrouted)
DATA09_L  (2 unrouted)
DATA10_L  (3 unrouted)
DATA11_L  (3 unrouted)
EIA_IN  (1 unrouted)
EIA_OUT  (2 unrouted)
EVN  (3 unrouted)
FILCH_H  (3 unrouted)
FILL  (3 unrouted)
FRAMING_ERR  (2 unrouted)
GND  (via drill 2.18)  (202 unrouted)
  Top 0.813: E9.10 247.52,180.34 | 247.52,180.34 v247.52,194.31 v257.68,194.31 | 247.52,180.34 v247.52,171.45
  pour Top: 231.01,195.58 231.01,170.18 261.49,170.18 261.49,175.26 261.49,195.58
HAS_ERROR  (1 unrouted)
INIT_H  (5 unrouted)
INIT_L  (7 unrouted)
INITIALIZE  (1 unrouted)
INT_ENAB_H  (1 unrouted)
INT_ENAB_L  (2 unrouted)
INT_RQST_L  (1 unrouted)
INTERNAL_IO_L  (1 unrouted)
IO_KCF_L  (2 unrouted)
IO_PAUSE_L  (1 unrouted)
IO_RDRRUN_L  (1 unrouted)
IO_READ_H  (10 unrouted)
IO_TCF_L  (1 unrouted)
IO_TPC_L  (2 unrouted)
MD03  (1 unrouted)
MD04  (1 unrouted)
MD05  (1 unrouted)
MD06  (1 unrouted)
MD07  (1 unrouted)
MD08  (1 unrouted)
MD09  (1 unrouted)
MD10  (1 unrouted)
MD11  (1 unrouted)
N$1  (2 unrouted)
N$2  (2 unrouted)
N$3  (2 unrouted)
N$4  (2 unrouted)
N$5  (2 unrouted)
N$6  (2 unrouted)
N$7  (2 unrouted)
N$8  (2 unrouted)
N$9  (2 unrouted)
N$10  (2 unrouted)
N$11  (2 unrouted)
N$12  (2 unrouted)
N$13  (2 unrouted)
N$14  (2 unrouted)
N$15  (2 unrouted)
N$16  (2 unrouted)
N$17  (2 unrouted)
N$18  (2 unrouted)
N$19  (8 unrouted)
N$20  (7 unrouted)
N$21  (3 unrouted)
N$22  (2 unrouted)
N$23  (2 unrouted)
N$24  (6 unrouted)
N$25  (1 unrouted)
N$26  (1 unrouted)
N$27  (2 unrouted)
N$28  (1 unrouted)
N$29  (3 unrouted)
N$30  (1 unrouted)
N$31  (1 unrouted)
N$32  (1 unrouted)
N$33  (1 unrouted)
N$34  (2 unrouted)
N$35  (1 unrouted)
N$36  (1 unrouted)
N$37  (1 unrouted)
N$38  (1 unrouted)
N$39  (2 unrouted)
N$40  (1 unrouted)
N$41  (1 unrouted)
N$42  (1 unrouted)
N$43  (1 unrouted)
N$44  (1 unrouted)
N$45  (1 unrouted)
N$46  (1 unrouted)
N$47  (1 unrouted)
N$48  (2 unrouted)
N$49  (4 unrouted)
N$50  (2 unrouted)
N$51  (1 unrouted)
N$52  (1 unrouted)
N$53  (2 unrouted)
N$54  (1 unrouted)
N$55  (1 unrouted)
N$56  (1 unrouted)
N$57  (2 unrouted)
N$58  (1 unrouted)
N$59  (2 unrouted)
N$60  (2 unrouted)
N$61  (1 unrouted)
N$62  (1 unrouted)
N$63  (1 unrouted)
N$65  (1 unrouted)
N$66  (1 unrouted)
N$67  (2 unrouted)
N$68  (1 unrouted)
N$69  (1 unrouted)
N$70  (1 unrouted)
N$71  (1 unrouted)
N$72  (1 unrouted)
N$73  (2 unrouted)
N$74  (1 unrouted)
N$75  (2 unrouted)
N$76  (1 unrouted)
N$77  (3 unrouted)
N$78  (1 unrouted)
N$79  (1 unrouted)
N$80  (4 unrouted)
N$81  (1 unrouted)
N$82  (1 unrouted)
N$83  (1 unrouted)
N$84  (1 unrouted)
N$85  (1 unrouted)
N$86  (1 unrouted)
N$87  (1 unrouted)
N$88  (1 unrouted)
N$89  (1 unrouted)
N$90  (1 unrouted)
N$91  (1 unrouted)
N$92  (1 unrouted)
N$93  (1 unrouted)
N$94  (2 unrouted)
N$95  (2 unrouted)
N$96  (2 unrouted)
N$97  (1 unrouted)
N$98  (2 unrouted)
N$99  (1 unrouted)
N$100  (1 unrouted)
N$101  (1 unrouted)
N$102  (1 unrouted)
N$103  (1 unrouted)
N$104  (1 unrouted)
N$105  (1 unrouted)
N$106  (1 unrouted)
N$107  (1 unrouted)
N$108  (1 unrouted)
N$110  (4 unrouted)
N$111  (1 unrouted)
N$112  (1 unrouted)
N$113  (2 unrouted)
N$114  (1 unrouted)
N$115  (1 unrouted)
N$116  (1 unrouted)
N$117  (1 unrouted)
N$118  (1 unrouted)
N$119  (2 unrouted)
N$120  (1 unrouted)
N$121  (1 unrouted)
N$122  (1 unrouted)
N$123  (2 unrouted)
N$124  (2 unrouted)
N$125  (3 unrouted)
N$126  (1 unrouted)
N$127  (1 unrouted)
N$128  (1 unrouted)
N$129  (2 unrouted)
N$130  (1 unrouted)
N$131  (2 unrouted)
N$132  (2 unrouted)
N$133  (4 unrouted)
N$134  (2 unrouted)
N$135  (2 unrouted)
N$136  (2 unrouted)
N$137  (1 unrouted)
N$138  (1 unrouted)
N$139  (2 unrouted)
N$140  (1 unrouted)
N$141  (2 unrouted)
N$142  (1 unrouted)
N$143  (1 unrouted)
N$144  (2 unrouted)
N$145  (2 unrouted)
N$146  (2 unrouted)
N$147  (1 unrouted)
N$148  (1 unrouted)
N$149  (2 unrouted)
NB1  (3 unrouted)
NB2  (3 unrouted)
NP  (3 unrouted)
OVERRUN_ERR  (2 unrouted)
P1.18US  (3 unrouted)
PARITY_ERR  (2 unrouted)
POWER_OK  (1 unrouted)
R=150  (4 unrouted)
RD0  (1 unrouted)
RD1  (1 unrouted)
RD2  (1 unrouted)
RD3  (1 unrouted)
RD4  (1 unrouted)
RD5  (1 unrouted)
RD6  (1 unrouted)
RD7  (1 unrouted)
READER_RUN+  (2 unrouted)
READER_RUN-  (1 unrouted)
RECV_0  (1 unrouted)
RECV_1  (1 unrouted)
RECV_5  (4 unrouted)
RECV_246  (2 unrouted)
RFLAG_H  (1 unrouted)
RFLAG_L  (1 unrouted)
RTSDTR  (2 unrouted)
RX20MA_DATA  (2 unrouted)
RX_20MA+  (1 unrouted)
RX_20MA-  (1 unrouted)
RX_CLK  (2 unrouted)
RX_DATA  (1 unrouted)
RX_DATA_AV  (2 unrouted)
SELECTED_H  (4 unrouted)
SELECTED_L  (3 unrouted)
SERIAL_IN  (1 unrouted)
SERIAL_OUT  (1 unrouted)
SKIP_L  (3 unrouted)
STAT_ENAB_L  (1 unrouted)
SWD  (4 unrouted)
TCLKI  (2 unrouted)
TCLKO  (2 unrouted)
TEST_SYNC  (3 unrouted)
TFLAG_H  (1 unrouted)
TFLAG_L  (1 unrouted)
TP3  (1 unrouted)
TRANS_0  (1 unrouted)
TRANS_1  (1 unrouted)
TRANS_5  (2 unrouted)
TRANS_246  (2 unrouted)
TSB  (4 unrouted)
TX_20MA+  (1 unrouted)
TX_20MA-  (1 unrouted)
TX_BUF_EMPTY  (2 unrouted)
TX_CLK  (2 unrouted)
TXD_STROBE  (2 unrouted)
VCC  (126 unrouted)
XR  (1 unrouted)